# Altium project PCB_Project.PrjPcb (part 2 of 4)

## Sheet HDMI_MIPI-DSI_EDP.SchDoc
size A4; SheetNumber: 9; SheetTotal: 26
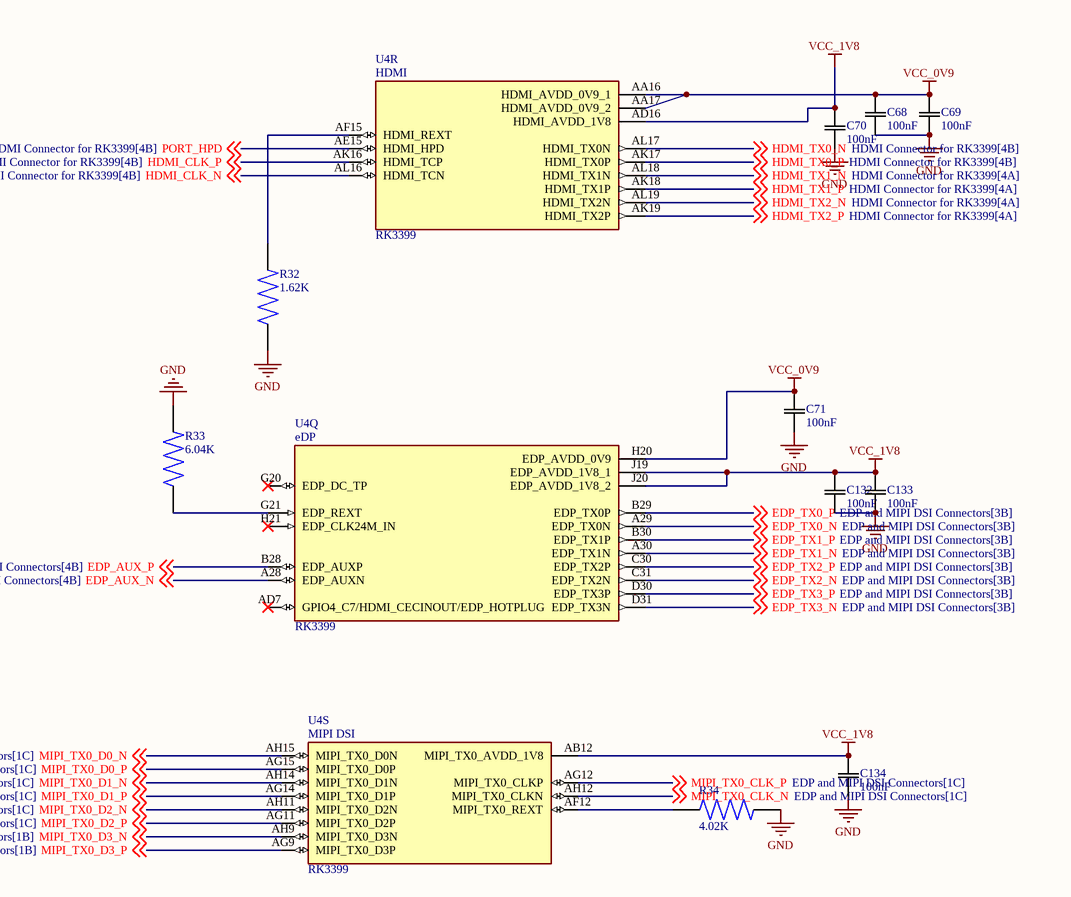
[diagram p8: HDMI_MIPI-DSI_EDP.SchDoc]

### Parts
C68  100nF  [CAP_1005_TDK]
C69  100nF  [CAP_1005_TDK]
C70  100nF  [CAP_1005_TDK]
C71  100nF  [CAP_1005_TDK]
C132  100nF  [CAP_1005_TDK]
C133  100nF  [CAP_1005_TDK]
C134  100nF  [CAP_1005_TDK]
R32  1.62K  [RES_ERA8APB1621V]
R33  6.04K  [RES_ERA8ARB6041V]
R34  4.02K  [RES_ERJP06F4021V]
U4  RK3399  [BGA828C65P31X31_2100X2100X161N]  (parts Q,R,S of 32)

### Nets
GND: C68.2 C69.2 C70.2 C71.2 C132.2 C133.2 C134.2 R32.1 R33.2 R34.2
VCC_0V9: C68.1 C69.1 C71.1 U4.AA16(HDMI_AVDD_0V9_1) U4.AA17(HDMI_AVDD_0V9_2) U4.H20(EDP_AVDD_0V9)
VCC_1V8: C70.1 C132.1 C133.1 C134.1 U4.AB12(MIPI_TX0_AVDD_1V8) U4.AD16(HDMI_AVDD_1V8) U4.J19(EDP_AVDD_1V8_1) U4.J20(EDP_AVDD_1V8_2)
EDP_AUX_N: U4.A28(EDP_AUXN) ; off-sheet EDP_AUX_N
EDP_AUX_P: U4.B28(EDP_AUXP) ; off-sheet EDP_AUX_P
EDP_TX0_N: U4.A29(EDP_TX0N) ; off-sheet EDP_TX0_N
EDP_TX0_P: U4.B29(EDP_TX0P) ; off-sheet EDP_TX0_P
EDP_TX1_N: U4.A30(EDP_TX1N) ; off-sheet EDP_TX1_N
EDP_TX1_P: U4.B30(EDP_TX1P) ; off-sheet EDP_TX1_P
EDP_TX2_N: U4.C31(EDP_TX2N) ; off-sheet EDP_TX2_N
EDP_TX2_P: U4.C30(EDP_TX2P) ; off-sheet EDP_TX2_P
EDP_TX3_N: U4.D31(EDP_TX3N) ; off-sheet EDP_TX3_N
EDP_TX3_P: U4.D30(EDP_TX3P) ; off-sheet EDP_TX3_P
HDMI_CLK_N: U4.AL16(HDMI_TCN) ; off-sheet HDMI_CLK_N
HDMI_CLK_P: U4.AK16(HDMI_TCP) ; off-sheet HDMI_CLK_P
HDMI_TX0_N: U4.AL17(HDMI_TX0N) ; off-sheet HDMI_TX0_N
HDMI_TX0_P: U4.AK17(HDMI_TX0P) ; off-sheet HDMI_TX0_P
HDMI_TX1_N: U4.AL18(HDMI_TX1N) ; off-sheet HDMI_TX1_N
HDMI_TX1_P: U4.AK18(HDMI_TX1P) ; off-sheet HDMI_TX1_P
HDMI_TX2_N: U4.AL19(HDMI_TX2N) ; off-sheet HDMI_TX2_N
HDMI_TX2_P: U4.AK19(HDMI_TX2P) ; off-sheet HDMI_TX2_P
MIPI_TX0_CLK_N: U4.AH12(MIPI_TX0_CLKN) ; off-sheet MIPI_TX0_CLK_N
MIPI_TX0_CLK_P: U4.AG12(MIPI_TX0_CLKP) ; off-sheet MIPI_TX0_CLK_P
MIPI_TX0_D0_N: U4.AH15(MIPI_TX0_D0N) ; off-sheet MIPI_TX0_D0_N
MIPI_TX0_D0_P: U4.AG15(MIPI_TX0_D0P) ; off-sheet MIPI_TX0_D0_P
MIPI_TX0_D1_N: U4.AH14(MIPI_TX0_D1N) ; off-sheet MIPI_TX0_D1_N
MIPI_TX0_D1_P: U4.AG14(MIPI_TX0_D1P) ; off-sheet MIPI_TX0_D1_P
MIPI_TX0_D2_N: U4.AH11(MIPI_TX0_D2N) ; off-sheet MIPI_TX0_D2_N
MIPI_TX0_D2_P: U4.AG11(MIPI_TX0_D2P) ; off-sheet MIPI_TX0_D2_P
MIPI_TX0_D3_N: U4.AH9(MIPI_TX0_D3N) ; off-sheet MIPI_TX0_D3_N
MIPI_TX0_D3_P: U4.AG9(MIPI_TX0_D3P) ; off-sheet MIPI_TX0_D3_P
PORT_HPD: U4.AE15(HDMI_HPD) ; off-sheet PORT_HPD
NetR32_2: R32.2 U4.AF15(HDMI_REXT)
NetR33_1: R33.1 U4.G21(EDP_REXT)
NetR34_1: R34.1 U4.AF12(MIPI_TX0_REXT)

Not connected (* = marked no-connect by the designer): U4 AD7(GPIO4_C7/HDMI_CECINOUT/EDP_HOTPLUG)* G20(EDP_DC_TP)* H21(EDP_CLK24M_IN)*

### Notes on the sheet
- (in symbol RK3399, part Q) eDP
- (in symbol RK3399, part R) HDMI
- (in symbol RK3399, part S) MIPI DSI

### Library data of the parts
C68-C71 C132-C134 = C1005X7R1H104M050BB: Description; Manufacturer_Name: TDK; Copyright: Copyright (C) 2025 Ultra Librarian. All rights reserved.; Manufacturer_Part_Number: C1005X7R1H104M050BB
R32 = ERA8APB1621V: Value: *; Price: None; Availability: Unavailable; Package: None; MP: ERA8APB1621V
R33 = ERA8ARB6041V: Package: None; MP: ERA8ARB6041V; Value: *; Availability: Unavailable; Price: None
R34 = ERJP06F4021V: Price: None; Value: *; Availability: Unavailable; Package: None; MP: ERJP06F4021V
U4 = RK3399: RK3399 ROCK Pi 4 Model A 2GB - ARMÂ® CortexÂ®-A53, CortexÂ®-A72 MPU Embedded Evaluation Board; MF: Rockchip; SnapEDA_Link: https://www.snapeda.com/parts/RK3399/Fuzhou+Rockchip+Electronics+Co/view-part/?ref=snap; Package: Seeed Technology; MP: RK3399; Check_prices: https://www.snapeda.com/parts/RK3399/Fuzhou+Rockchip+Electronics+Co/view-part/?ref=eda; Price: None; Value: *; Availability: Not in stock

## Sheet HDMI Connector for RK3399.SchDoc
size A4; SheetNumber: 10; SheetTotal: 26
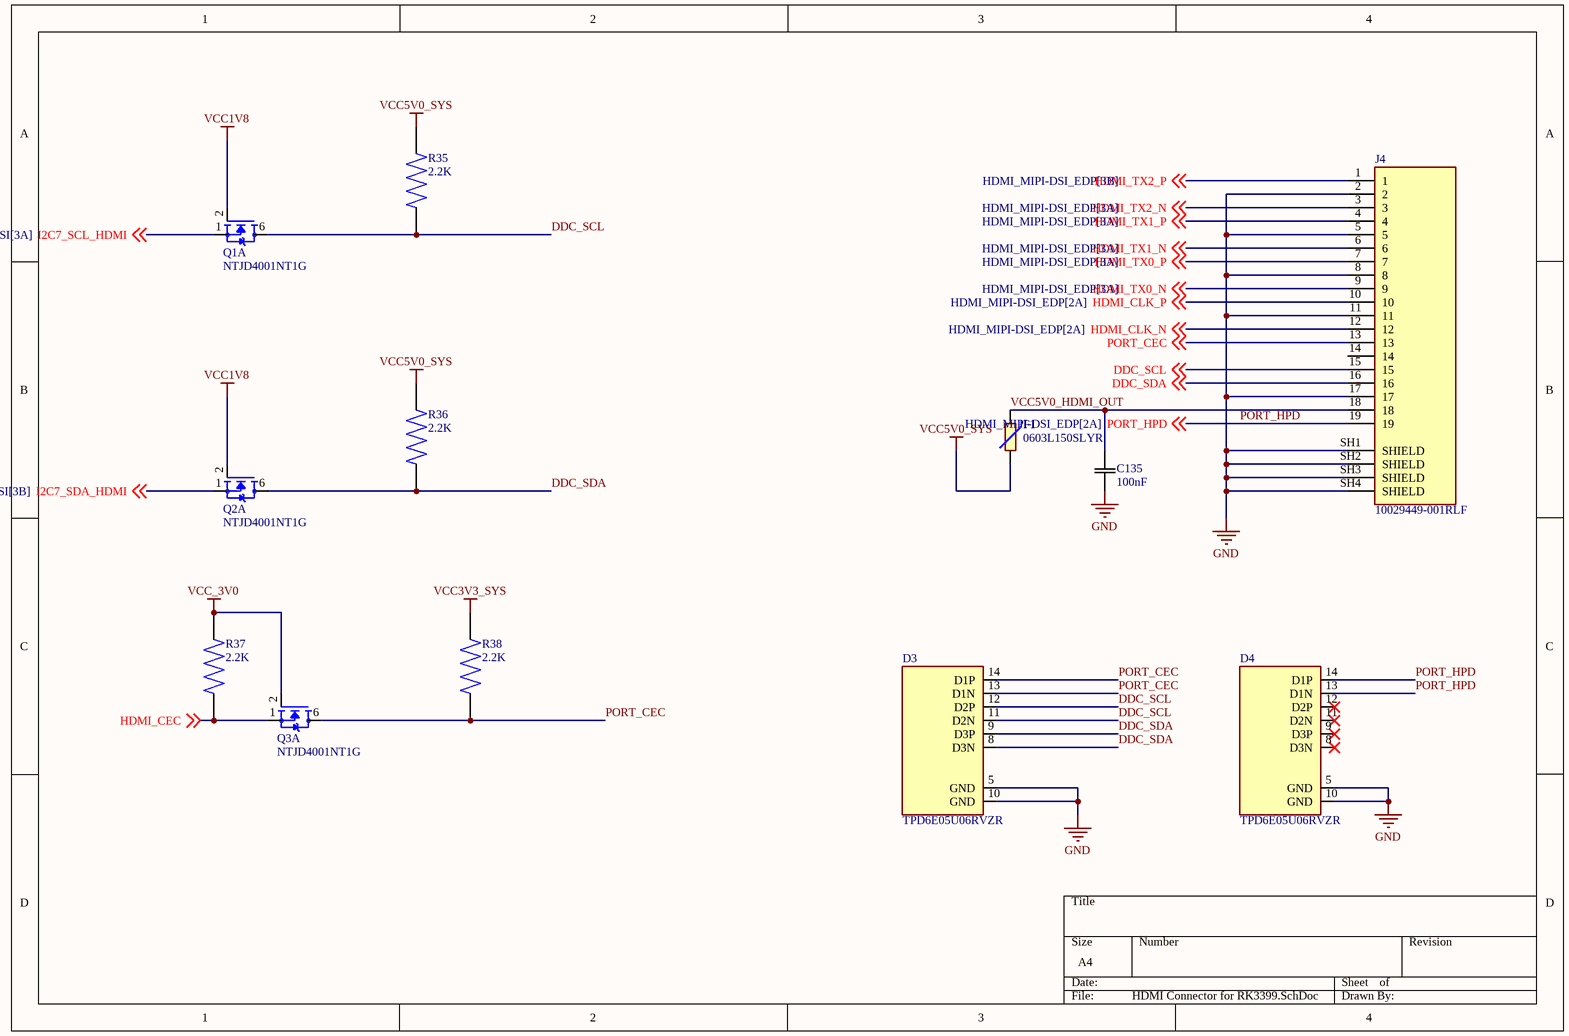
[diagram p9: HDMI Connector for RK3399.SchDoc]

### Parts
C135  100nF  [CAP_1005_TDK]
D3  TPD6E05U06RVZR  [SON50P135X350X55-14N]
D4  TPD6E05U06RVZR  [SON50P135X350X55-14N]
F1  0603L150SLYR  [FUSC1608X100N]
J4  10029449-001RLF  [AMPHENOL_10029449-001RLF]
Q1  NTJD4001NT1G  [SOT65P210X110-6N]  (part A of 2)
Q2  NTJD4001NT1G  [SOT65P210X110-6N]  (part A of 2)
Q3  NTJD4001NT1G  [SOT65P210X110-6N]  (part A of 2)
R35  2.2K  [RES_ERA8APB222V]
R36  2.2K  [RES_ERA8APB222V]
R37  2.2K  [RES_ERA8APB222V]
R38  2.2K  [RES_ERA8APB222V]

### Nets
GND: C135.2 D3.5(GND) D3.10(GND) D4.5(GND) D4.10(GND) J4.2 J4.5 J4.8 J4.11 J4.17 J4.SH1(SHIELD) J4.SH2(SHIELD) J4.SH3(SHIELD) J4.SH4(SHIELD)
VCC1V8: Q1.2(G1) Q2.2(G1)
VCC3V3_SYS: R38.2
VCC5V0_SYS: F1.2 R35.2 R36.2
VCC_3V0: Q3.2(G1) R37.2
DDC_SCL: D3.11(D2N) D3.12(D2P) J4.15 Q1.6(D1) R35.1 ; off-sheet DDC_SCL
DDC_SDA: D3.8(D3N) D3.9(D3P) J4.16 Q2.6(D1) R36.1 ; off-sheet DDC_SDA
HDMI_CEC: Q3.1(S1) R37.1 ; off-sheet HDMI_CEC
HDMI_CLK_N: J4.12 ; off-sheet HDMI_CLK_N
HDMI_CLK_P: J4.10 ; off-sheet HDMI_CLK_P
HDMI_TX0_N: J4.9 ; off-sheet HDMI_TX0_N
HDMI_TX0_P: J4.7 ; off-sheet HDMI_TX0_P
HDMI_TX1_N: J4.6 ; off-sheet HDMI_TX1_N
HDMI_TX1_P: J4.4 ; off-sheet HDMI_TX1_P
HDMI_TX2_N: J4.3 ; off-sheet HDMI_TX2_N
HDMI_TX2_P: J4.1 ; off-sheet HDMI_TX2_P
I2C7_SCL_HDMI: Q1.1(S1) ; off-sheet I2C7_SCL_HDMI
I2C7_SDA_HDMI: Q2.1(S1) ; off-sheet I2C7_SDA_HDMI
PORT_CEC: D3.13(D1N) D3.14(D1P) J4.13 Q3.6(D1) R38.1 ; off-sheet PORT_CEC
PORT_HPD: D4.13(D1N) D4.14(D1P) J4.19 ; off-sheet PORT_HPD
VCC5V0_HDMI_OUT: C135.1 F1.1 J4.18

Not connected (* = marked no-connect by the designer): D4 8(D3N)* 9(D3P)* 11(D2N)* 12(D2P)*; J4 14

### Library data of the parts
C135 = C1005X7R1H104M050BB: Description; Manufacturer_Name: TDK; Copyright: Copyright (C) 2025 Ultra Librarian. All rights reserved.; Manufacturer_Part_Number: C1005X7R1H104M050BB
D3 D4 = TPD6E05U06RVZR: 6-Channel Ultra low capacitance IEC ESD protection diodes 14-USON -40 to 125; MP: TPD6E05U06RVZR; Price: None; Package: None; Value: *; Availability: Unavailable
F1 = 0603L150SLYR: Polymeric PTC Resettable Fuse 6V 1.5 A Ih Surface Mount 0603 (1608 Metric), Concave; MF: Littelfuse Inc.; SnapEDA_Link: https://www.snapeda.com/parts/0603L150SLYR/Littelfuse/view-part/?ref=snap; Package: 0603-2 LITTELFUSE; Value: *; MP: 0603L150SLYR; Check_prices: https://www.snapeda.com/parts/0603L150SLYR/Littelfuse/view-part/?ref=eda
Q1-Q3 = NTJD4001NT1G: Mosfet Array 2 N-Channel (Dual) 30V 250mA 272mW Surface Mount SC-88/SC70-6/SOT-363; MF: ON Semiconductor; SnapEDA_Link: https://www.snapeda.com/parts/NTJD4001NT1G/Onsemi/view-part/?ref=snap; Package: SC-88-6 ON Semiconductor; Value: *; MP: NTJD4001NT1G; Check_prices: https://www.snapeda.com/parts/NTJD4001NT1G/Onsemi/view-part/?ref=eda
R35-R38 = ERA8APB222V: Availability: Unavailable; Price: None; Package: None; MP: ERA8APB222V; Value: *
J4 = 10029449-001RLF: Package: None; Price: None; Value: *; MP: 10029449-001RLF; Availability: Unavailable

## Sheet PMIC_Block_.SchDoc
size A3; SheetNumber: 11; SheetTotal: 26
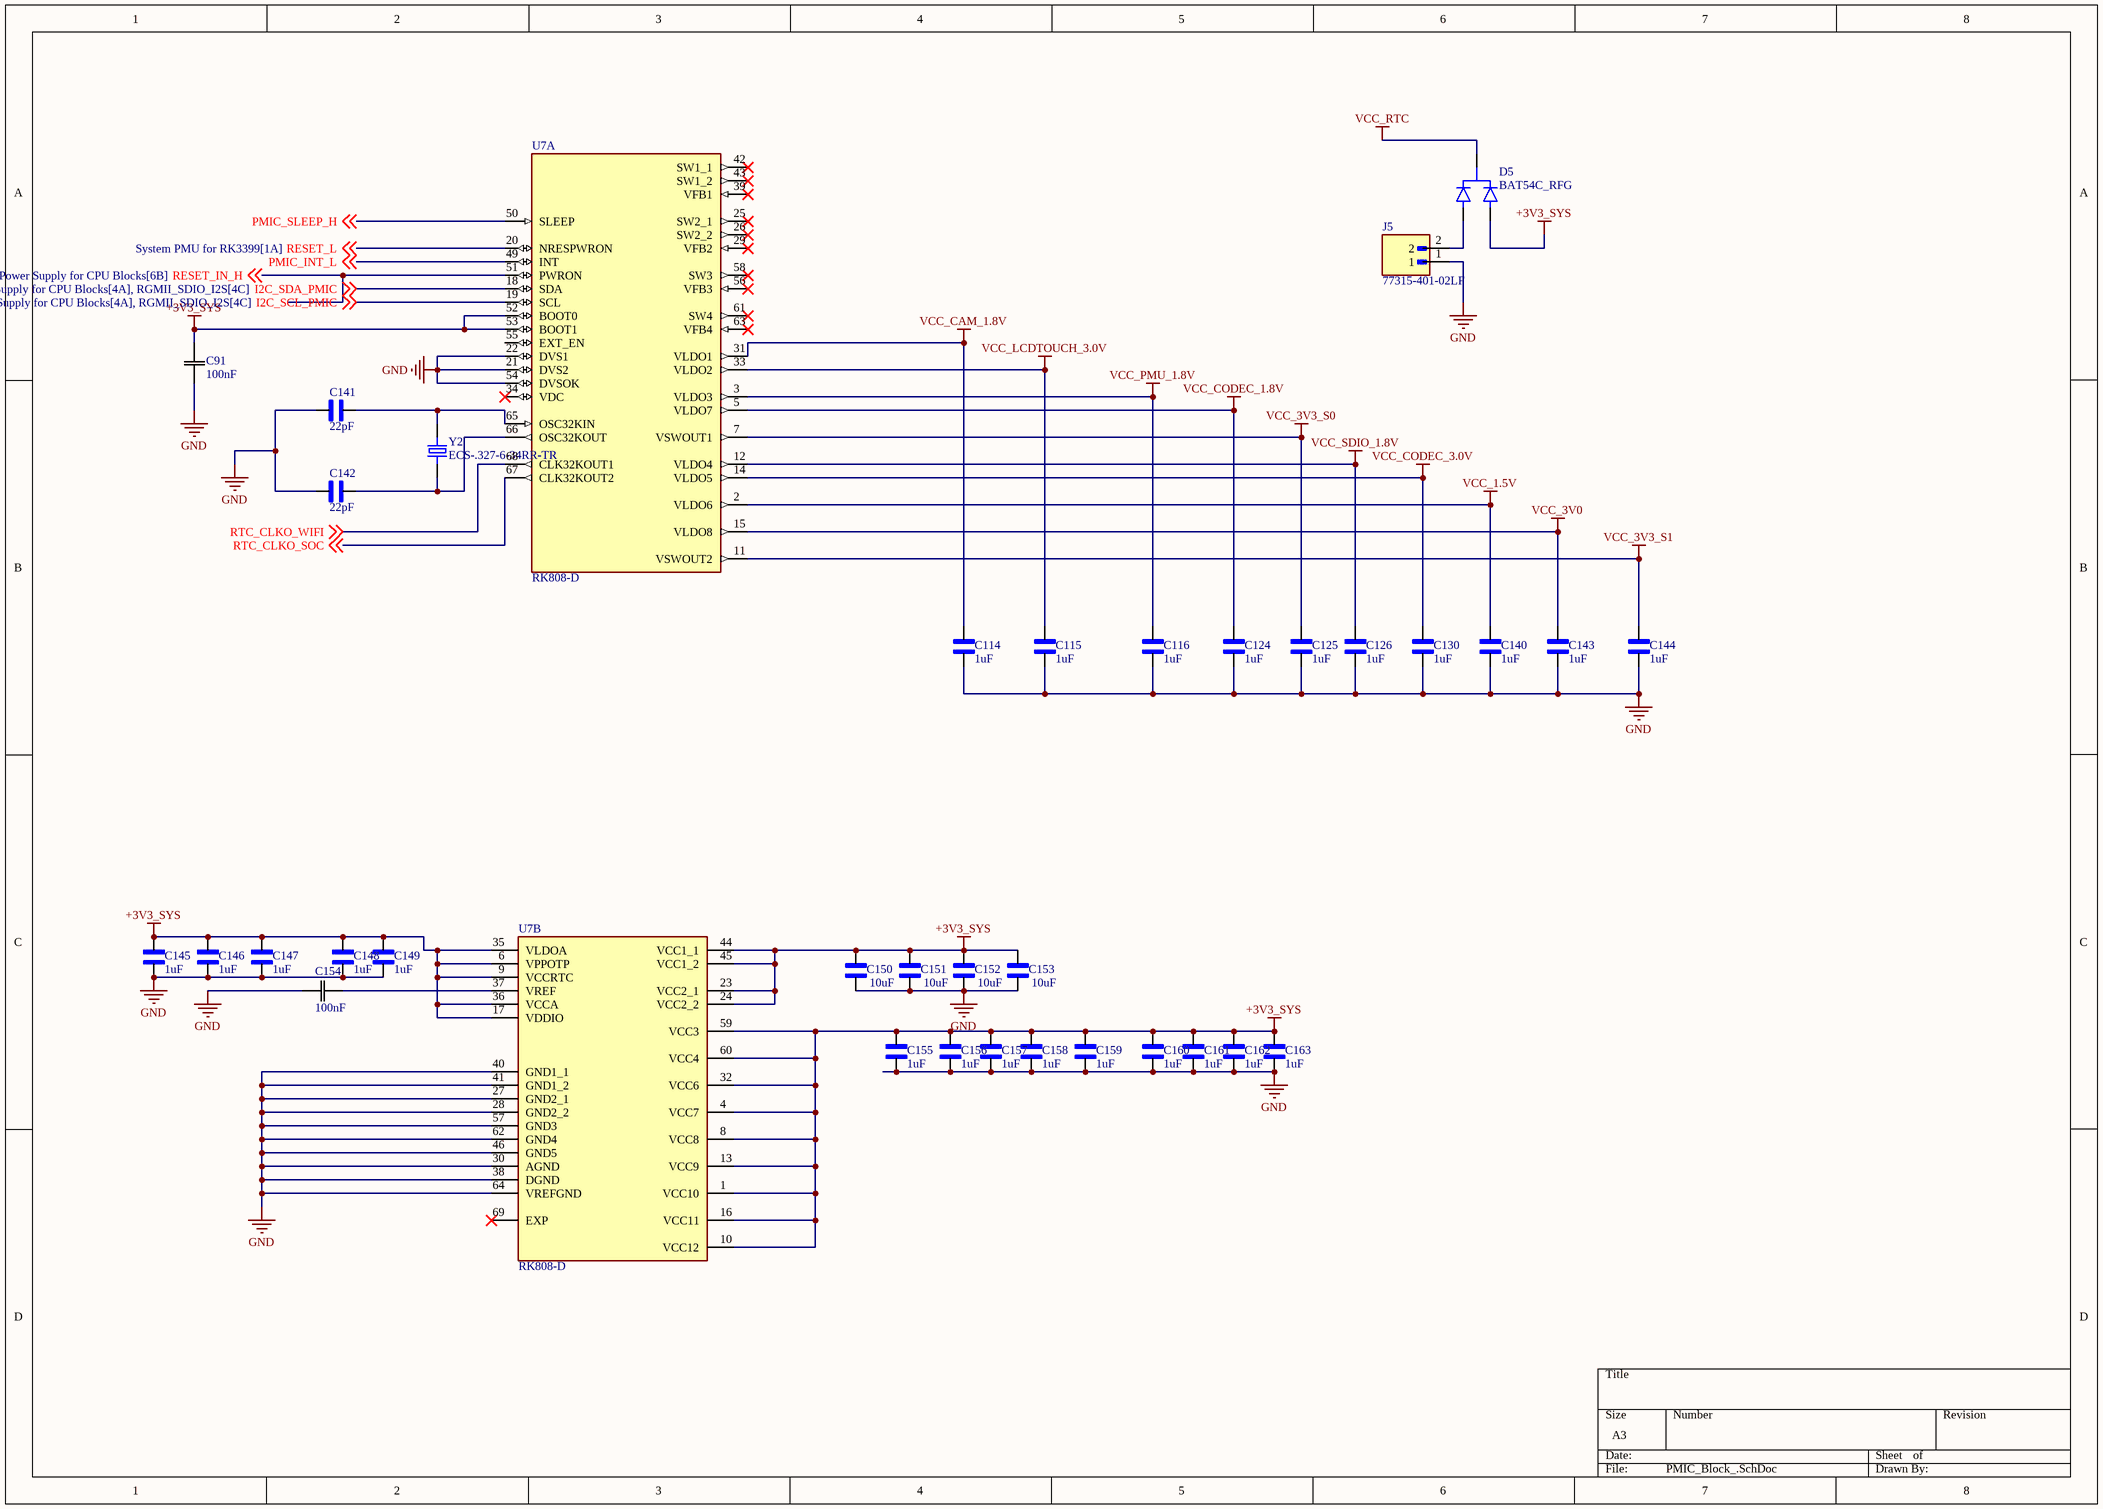
[diagram p10: PMIC_Block_.SchDoc]

### Parts
C91  100nF  [CAP_1005_TDK]
C114  1uF  [CAPC1005X56N]
C115  1uF  [CAPC1005X56N]
C116  1uF  [CAPC1005X56N]
C124  1uF  [CAPC1005X56N]
C125  1uF  [CAPC1005X56N]
C126  1uF  [CAPC1005X56N]
C130  1uF  [CAPC1005X56N]
C140  1uF  [CAPC1005X56N]
C141  22pF  [CAPC2012X140N]
C142  22pF  [CAPC2012X140N]
C143  1uF  [CAPC1005X56N]
C144  1uF  [CAPC1005X56N]
C145  1uF  [CAPC1005X56N]
C146  1uF  [CAPC1005X56N]
C147  1uF  [CAPC1005X56N]
C148  1uF  [CAPC1005X56N]
C149  1uF  [CAPC1005X56N]
C150  10uF  [CAPC1005X70N]
C151  10uF  [CAPC1005X70N]
C152  10uF  [CAPC1005X70N]
C153  10uF  [CAPC1005X70N]
C154  100nF  [CAP_1005_TDK]
C155  1uF  [CAPC1005X56N]
C156  1uF  [CAPC1005X56N]
C157  1uF  [CAPC1005X56N]
C158  1uF  [CAPC1005X56N]
C159  1uF  [CAPC1005X56N]
C160  1uF  [CAPC1005X56N]
C161  1uF  [CAPC1005X56N]
C162  1uF  [CAPC1005X56N]
C163  1uF  [CAPC1005X56N]
D5  BAT54C_RFG  [SOT95P237X112-3N]
J5  77315-401-02LF  [AMPHENOL_77315-401-02LF]
U7  RK808-D  [QFN35P700X700X80-69N]  (parts A,B of 2)
Y2  ECS-.327-6-34RR-TR  [XTAL_ECS-.327-6-34RR-TR]

### Nets
+3V3_SYS: C91.2 C145.2 C146.2 C147.2 C148.2 C149.2 C150.2 C151.2 C152.2 C153.2 C155.2 C156.2 C157.2 C158.2 C159.2 C160.2 C161.2 C162.2 C163.2 D5.2 U7.1(VCC10) U7.4(VCC7) U7.6(VPPOTP) U7.8(VCC8) U7.9(VCCRTC) U7.10(VCC12) U7.13(VCC9) U7.16(VCC11) U7.17(VDDIO) U7.23(VCC2_1) U7.24(VCC2_2) U7.32(VCC6) U7.35(VLDOA) U7.36(VCCA) U7.44(VCC1_1) U7.45(VCC1_2) U7.52(BOOT0) U7.53(BOOT1) U7.59(VCC3) U7.60(VCC4)
GND: C91.1 C114.1 C115.1 C116.1 C124.1 C125.1 C126.1 C130.1 C140.1 C141.2 C142.2 C143.1 C144.1 C145.1 C146.1 C147.1 C148.1 C149.1 C150.1 C151.1 C152.1 C153.1 C154.2 C155.1 C156.1 C157.1 C158.1 C159.1 C160.1 C161.1 C162.1 C163.1 J5.1 U7.21(DVS2) U7.22(DVS1) U7.27(GND2_1) U7.28(GND2_2) U7.30(AGND) U7.38(DGND) U7.40(GND1_1) U7.41(GND1_2) U7.46(GND5) U7.54(DVSOK) U7.57(GND3) U7.62(GND4) U7.64(VREFGND)
RESET_IN_H: U7.51(PWRON) ; off-sheet RESET_IN_H  [project net VCC3V3_S5]
VCC_1.5V: C140.2 U7.2(VLDO6)
VCC_3V0: C143.2 U7.15(VLDO8)
VCC_3V3_S0: C125.2 U7.7(VSWOUT1)
VCC_3V3_S1: C144.2 U7.11(VSWOUT2)
VCC_CAM_1.8V: C114.2 U7.31(VLDO1)
VCC_CODEC_1.8V: C124.2 U7.5(VLDO7)
VCC_CODEC_3.0V: C130.2 U7.14(VLDO5)
VCC_LCDTOUCH_3.0V: C115.2 U7.33(VLDO2)
VCC_PMU_1.8V: C116.2 U7.3(VLDO3)
VCC_RTC: D5.3
VCC_SDIO_1.8V: C126.2 U7.12(VLDO4)
I2C_SCL_PMIC: U7.19(SCL) ; off-sheet I2C_SCL_PMIC
I2C_SDA_PMIC: U7.18(SDA) ; off-sheet I2C_SDA_PMIC
PMIC_INT_L: U7.49(INT) ; off-sheet PMIC_INT_L
PMIC_SLEEP_H: U7.50(SLEEP) ; off-sheet PMIC_SLEEP_H
RESET_L: U7.20(NRESPWRON) ; off-sheet RESET_L
RTC_CLKO_SOC: U7.67(CLK32KOUT2) ; off-sheet RTC_CLKO_SOC
RTC_CLKO_WIFI: U7.68(CLK32KOUT1) ; off-sheet RTC_CLKO_WIFI
NetC141_1: C141.1 U7.65(OSC32KIN) Y2.2(O/I)
NetC142_1: C142.1 U7.66(OSC32KOUT) Y2.1(I/O)
NetC154_1: C154.1 U7.37(VREF)
NetD5_1: D5.1 J5.2

Not connected (* = marked no-connect by the designer): U7 25(SW2_1)* 26(SW2_2)* 29(VFB2)* 34(VDC)* 39(VFB1)* 42(SW1_1)* 43(SW1_2)* 55(EXT_EN) 56(VFB3)* 58(SW3)* 61(SW4)* 63(VFB4)* 69(EXP)*

### Library data of the parts
C91 C154 = C1005X7R1H104M050BB: Description; Manufacturer_Name: TDK; Copyright: Copyright (C) 2025 Ultra Librarian. All rights reserved.; Manufacturer_Part_Number: C1005X7R1H104M050BB
C114-C116 C124-C126 C130 C140 C143-C149 C155-C163 = 0402ZD105KAT4A: as C13 on sheet TYPEC0; SnapEDA_Link: https://www.snapeda.com/parts/0402ZD105KAT4A/AVX/view-part/?ref=snap; Package: 1005 AVX; Value: *; MP: 0402ZD105KAT4A; Check_prices: https://www.snapeda.com/parts/0402ZD105KAT4A/AVX/view-part/?ref=eda
C141 C142 = C0805C220J5GACTU: Capacitor, Ceramic, Cap, 22.0pF, Tol 5%, SMT, 50V, C0G | KEMET C0805C220J5GACTU; SnapEDA_Link: https://www.snapeda.com/parts/C0805C220J5GACTU/KEMET/view-part/?ref=snap; Package: 0805 Kemet; Value: *; MF: KEMET; MP: C0805C220J5GACTU; Check_prices: https://www.snapeda.com/parts/C0805C220J5GACTU/KEMET/view-part/?ref=eda
C150-C153 = CL05A106MQ5NUNC: as C1 on sheet USB2.0; SnapEDA_Link: https://www.snapeda.com/parts/CL05A106MQ5NUNC/Samsung/view-part/?ref=snap; Package: SMD-2 Samsung; Value: *; MP: CL05A106MQ5NUNC; Check_prices: https://www.snapeda.com/parts/CL05A106MQ5NUNC/Samsung/view-part/?ref=eda
D5 = BAT54C_RFG: SOT-23, 30V, 0.2A, Schottky Diode; MF: Taiwan Semiconductor; MP: BAT54C RF; SnapEDA_Link: https://www.snapeda.com/parts/BAT54C%20RF/Taiwan+Semiconductor/view-part/?ref=snap; Package: SOT-23 Taiwan Semiconductor; Value: *; Check_prices: https://www.snapeda.com/parts/BAT54C%20RF/Taiwan+Semiconductor/view-part/?ref=eda
U7 = RK808-D: RK808-D Power Management IC; MF: rockchip; SnapEDA_Link: https://www.snapeda.com/parts/RK808-D/Rockchip/view-part/?ref=snap; Package: None; Value: *; MP: RK808-D; Check_prices: https://www.snapeda.com/parts/RK808-D/Rockchip/view-part/?ref=eda
Y2 = ECS-.327-6-34RR-TR: 32.768kHz 20ppm Crystal 6pF 20 kOhm -40C ~ 85C Surface Mount 2-SMD, No Lead 3.2 x 1.5; MF: ECS Inc.; SnapEDA_Link: https://www.snapeda.com/parts/ECS-.327-6-34RR-TR/ECS/view-part/?ref=snap; Package: ECX-34RR-34RR-2 ECS; Value: *; MP: ECS-.327-6-34RR-TR; Check_prices: https://www.snapeda.com/parts/ECS-.327-6-34RR-TR/ECS/view-part/?ref=eda
J5 = 77315-401-02LF: Package: None; Price: None; Value: *; MP: 77315-401-02LF; Availability: Unavailable

## Sheet LPDDR4 SDRAM_1.SchDoc
size 420 x 297 mm; SheetNumber: 12; SheetTotal: 26
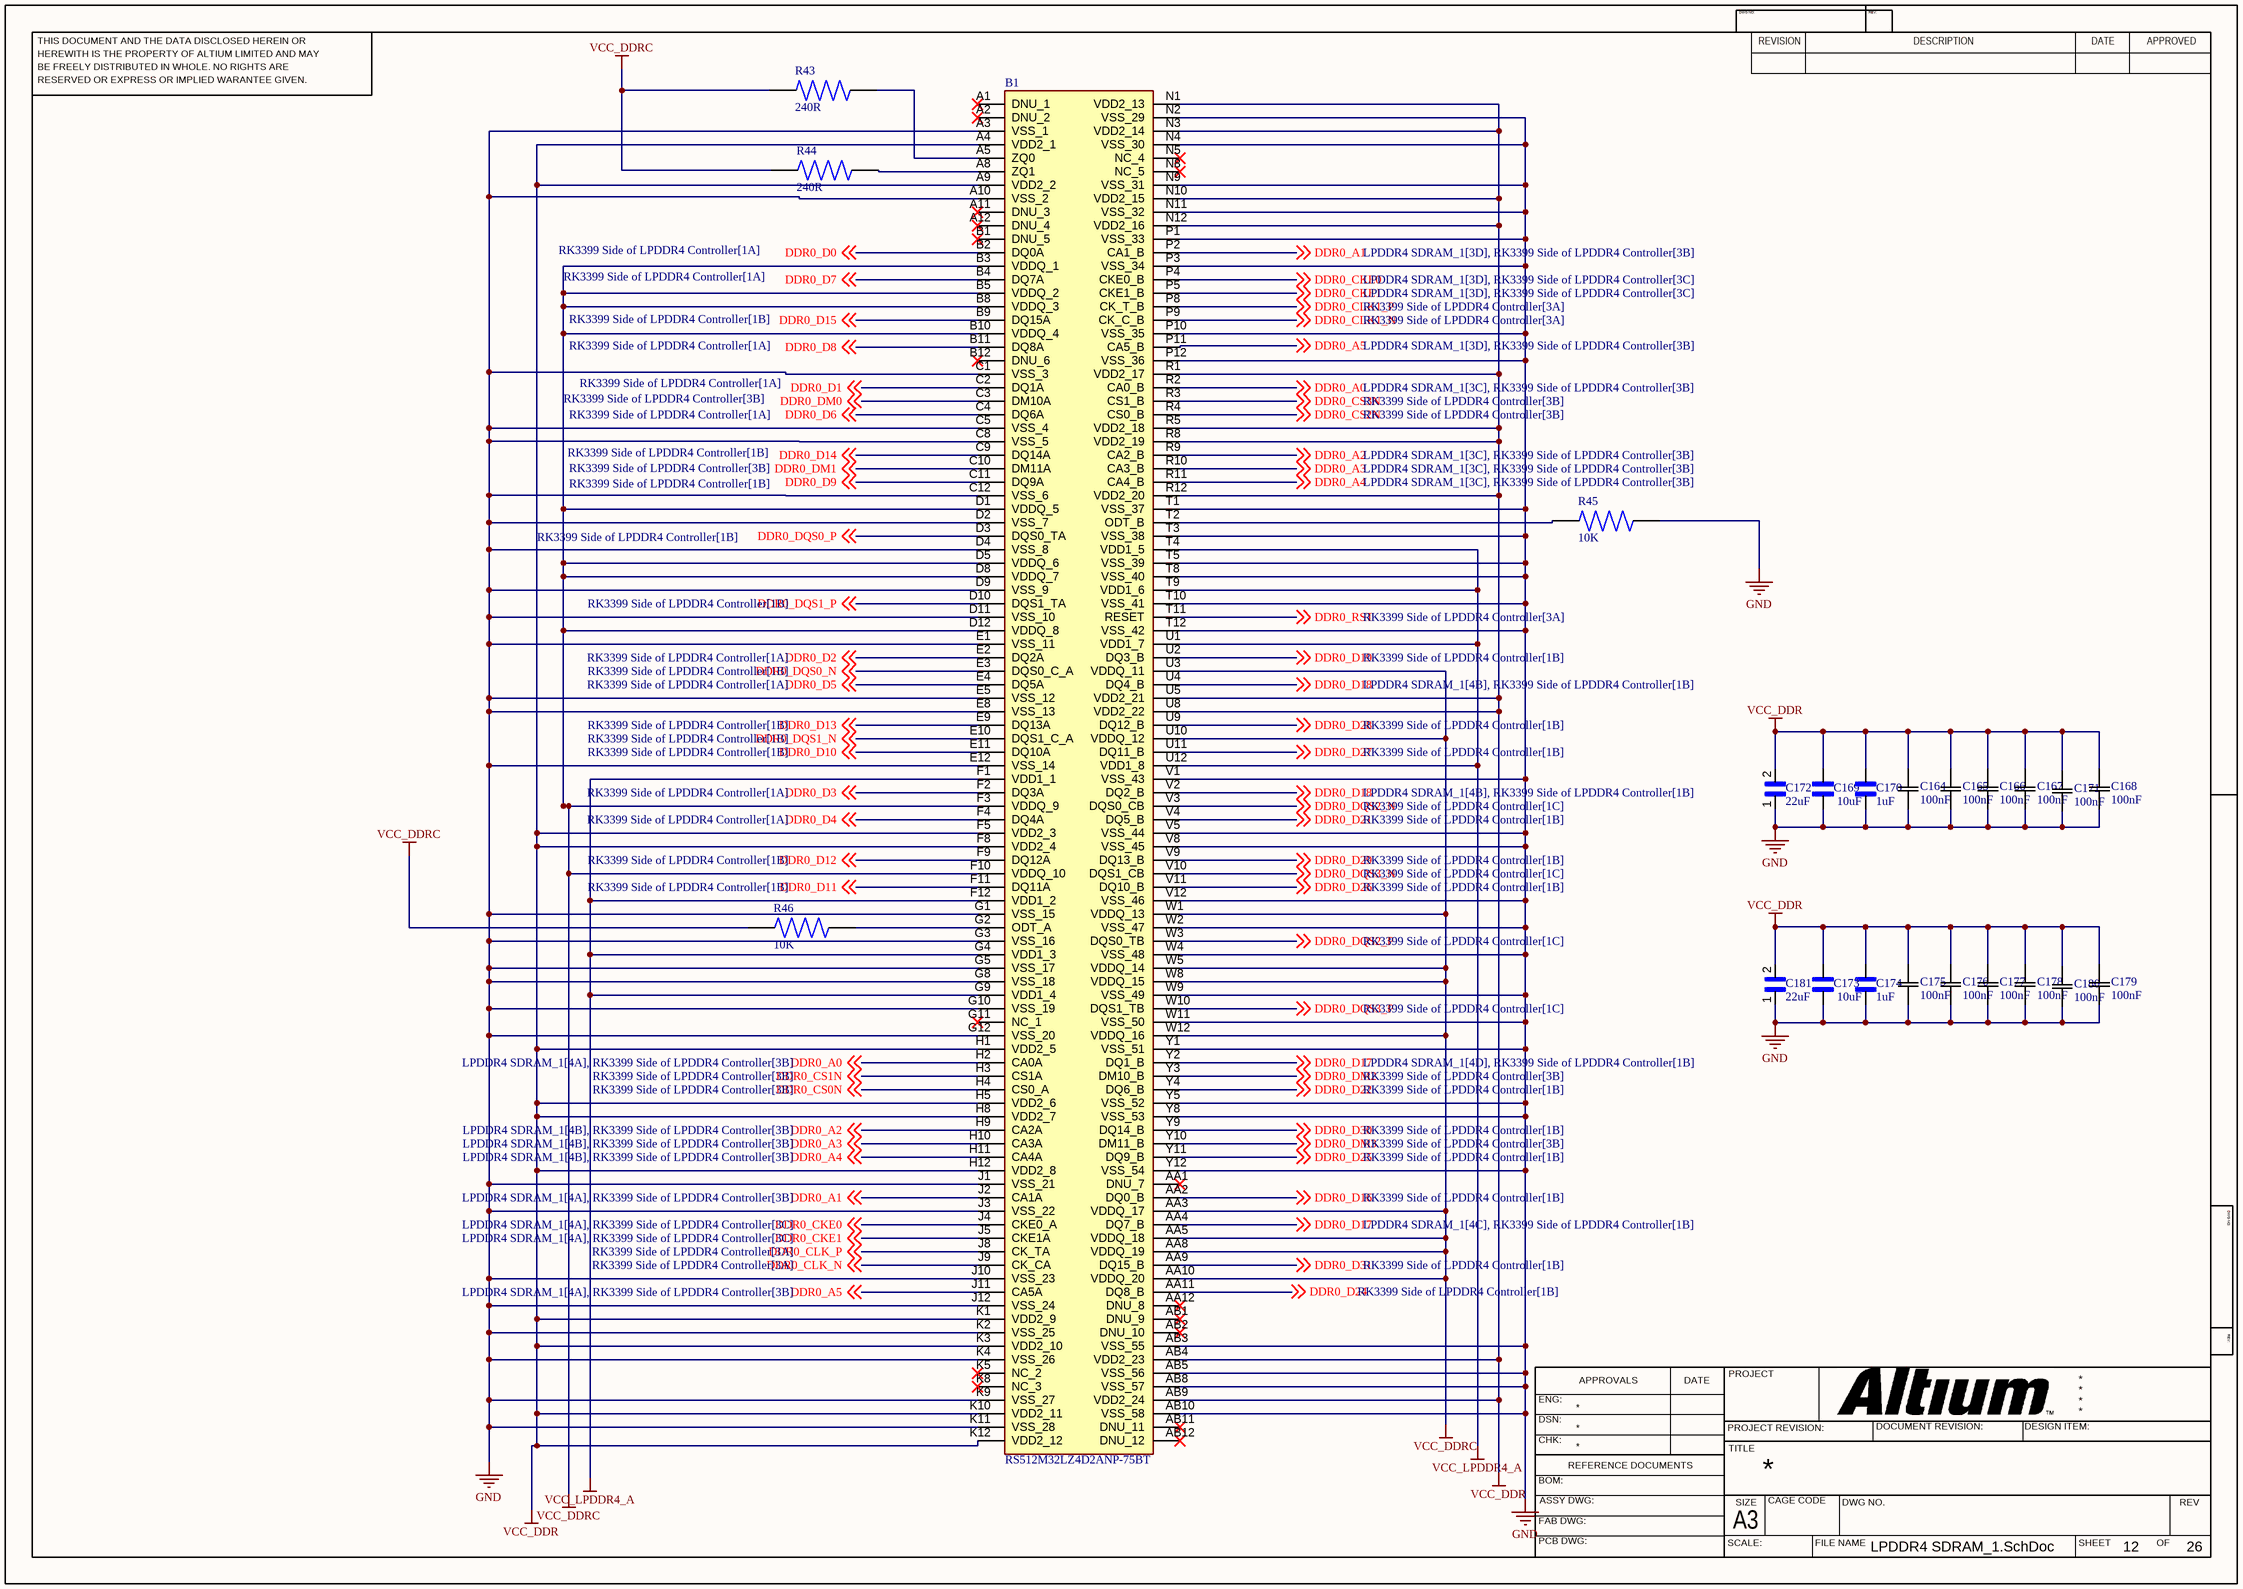
[diagram p11: LPDDR4 SDRAM_1.SchDoc]

### Parts
B1  RS512M32LZ4D2ANP-75BT  [BGA200C65P12X22_1000X1500X100]
C164  100nF  [CAP_1005_TDK]
C165  100nF  [CAP_1005_TDK]
C166  100nF  [CAP_1005_TDK]
C167  100nF  [CAP_1005_TDK]
C168  100nF  [CAP_1005_TDK]
C169  10uF  [CAPC1005X70N]
C170  1uF  [CAPC1005X56N]
C171  100nF  [CAP_1005_TDK]
C172  22uF  [CAPC6050X550N]
C173  10uF  [CAPC1005X70N]
C174  1uF  [CAPC1005X56N]
C175  100nF  [CAP_1005_TDK]
C176  100nF  [CAP_1005_TDK]
C177  100nF  [CAP_1005_TDK]
C178  100nF  [CAP_1005_TDK]
C179  100nF  [CAP_1005_TDK]
C180  100nF  [CAP_1005_TDK]
C181  22uF  [CAPC6050X550N]
R43  240R  [RESC1608X50N]
R44  240R  [RESC1608X50N]
R45  10K  [RESC1608X55N]
R46  10K  [RESC1608X55N]

### Nets
GND: B1.A3(VSS_1) B1.A10(VSS_2) B1.AB3(VSS_55) B1.AB5(VSS_56) B1.AB8(VSS_57) B1.AB10(VSS_58) B1.C1(VSS_3) B1.C5(VSS_4) B1.C8(VSS_5) B1.C12(VSS_6) B1.D2(VSS_7) B1.D4(VSS_8) B1.D9(VSS_9) B1.D11(VSS_10) B1.E1(VSS_11) B1.E5(VSS_12) B1.E8(VSS_13) B1.E12(VSS_14) B1.G1(VSS_15) B1.G3(VSS_16) B1.G5(VSS_17) B1.G8(VSS_18) B1.G10(VSS_19) B1.G12(VSS_20) B1.J1(VSS_21) B1.J3(VSS_22) B1.J10(VSS_23) B1.J12(VSS_24) B1.K2(VSS_25) B1.K4(VSS_26) B1.K9(VSS_27) B1.K11(VSS_28) B1.N2(VSS_29) B1.N4(VSS_30) B1.N9(VSS_31) B1.N11(VSS_32) B1.P1(VSS_33) B1.P3(VSS_34) B1.P10(VSS_35) B1.P12(VSS_36) B1.T1(VSS_37) B1.T3(VSS_38) B1.T5(VSS_39) B1.T8(VSS_40) B1.T10(VSS_41) B1.T12(VSS_42) B1.V1(VSS_43) B1.V5(VSS_44) B1.V8(VSS_45) B1.V12(VSS_46) B1.W2(VSS_47) B1.W4(VSS_48) B1.W9(VSS_49) B1.W11(VSS_50) B1.Y1(VSS_51) B1.Y5(VSS_52) B1.Y8(VSS_53) B1.Y12(VSS_54) C164.1 C165.1 C166.1 C167.1 C168.1 C169.1 C170.1 C171.1 C172.1 C173.1 C174.1 C175.1 C176.1 C177.1 C178.1 C179.1 C180.1 C181.1 R45.2
VCC_DDR: B1.A4(VDD2_1) B1.A9(VDD2_2) B1.AB4(VDD2_23) B1.AB9(VDD2_24) B1.F5(VDD2_3) B1.F8(VDD2_4) B1.H1(VDD2_5) B1.H5(VDD2_6) B1.H8(VDD2_7) B1.H12(VDD2_8) B1.K1(VDD2_9) B1.K3(VDD2_10) B1.K10(VDD2_11) B1.K12(VDD2_12) B1.N1(VDD2_13) B1.N3(VDD2_14) B1.N10(VDD2_15) B1.N12(VDD2_16) B1.R1(VDD2_17) B1.R5(VDD2_18) B1.R8(VDD2_19) B1.R12(VDD2_20) B1.U5(VDD2_21) B1.U8(VDD2_22) C164.2 C165.2 C166.2 C167.2 C168.2 C169.2 C170.2 C171.2 C172.2 C173.2 C174.2 C175.2 C176.2 C177.2 C178.2 C179.2 C180.2 C181.2
VCC_DDRC: B1.AA3(VDDQ_17) B1.AA5(VDDQ_18) B1.AA8(VDDQ_19) B1.AA10(VDDQ_20) B1.B3(VDDQ_1) B1.B5(VDDQ_2) B1.B8(VDDQ_3) B1.B10(VDDQ_4) B1.D1(VDDQ_5) B1.D5(VDDQ_6) B1.D8(VDDQ_7) B1.D12(VDDQ_8) B1.F3(VDDQ_9) B1.F10(VDDQ_10) B1.U3(VDDQ_11) B1.U10(VDDQ_12) B1.W1(VDDQ_13) B1.W5(VDDQ_14) B1.W8(VDDQ_15) B1.W12(VDDQ_16) R43.1 R44.1 R46.2
VCC_LPDDR4_A: B1.F1(VDD1_1) B1.F12(VDD1_2) B1.G4(VDD1_3) B1.G9(VDD1_4) B1.T4(VDD1_5) B1.T9(VDD1_6) B1.U1(VDD1_7) B1.U12(VDD1_8)
DDR0_A0: B1.H2(CA0A) B1.R2(CA0_B) ; off-sheet DDR0_A0
DDR0_A1: B1.J2(CA1A) B1.P2(CA1_B) ; off-sheet DDR0_A1
DDR0_A2: B1.H9(CA2A) B1.R9(CA2_B) ; off-sheet DDR0_A2
DDR0_A3: B1.H10(CA3A) B1.R10(CA3_B) ; off-sheet DDR0_A3
DDR0_A4: B1.H11(CA4A) B1.R11(CA4_B) ; off-sheet DDR0_A4
DDR0_A5: B1.J11(CA5A) B1.P11(CA5_B) ; off-sheet DDR0_A5
DDR0_CKE0: B1.J4(CKE0_A) B1.P4(CKE0_B) ; off-sheet DDR0_CKE0
DDR0_CKE1: B1.J5(CKE1A) B1.P5(CKE1_B) ; off-sheet DDR0_CKE1
DDR0_CLK1_N: B1.P9(CK_C_B) ; off-sheet DDR0_CLK1_N
DDR0_CLK1_P: B1.P8(CK_T_B) ; off-sheet DDR0_CLK1_P
DDR0_CLK_N: B1.J9(CK_CA) ; off-sheet DDR0_CLK_N
DDR0_CLK_P: B1.J8(CK_TA) ; off-sheet DDR0_CLK_P
DDR0_CS0N: B1.H4(CS0_A) ; off-sheet DDR0_CS0N
DDR0_CS1N: B1.H3(CS1A) ; off-sheet DDR0_CS1N
DDR0_CS2N: B1.R4(CS0_B) ; off-sheet DDR0_CS2N
DDR0_CS3N: B1.R3(CS1_B) ; off-sheet DDR0_CS3N
DDR0_D0: B1.B2(DQ0A) ; off-sheet DDR0_D0
DDR0_D1: B1.C2(DQ1A) ; off-sheet DDR0_D1
DDR0_D2: B1.E2(DQ2A) ; off-sheet DDR0_D2
DDR0_D3: B1.F2(DQ3A) ; off-sheet DDR0_D3
DDR0_D4: B1.F4(DQ4A) ; off-sheet DDR0_D4
DDR0_D5: B1.E4(DQ5A) ; off-sheet DDR0_D5
DDR0_D6: B1.C4(DQ6A) ; off-sheet DDR0_D6
DDR0_D7: B1.B4(DQ7A) ; off-sheet DDR0_D7
DDR0_D8: B1.B11(DQ8A) ; off-sheet DDR0_D8
DDR0_D9: B1.C11(DQ9A) ; off-sheet DDR0_D9
DDR0_D10: B1.E11(DQ10A) ; off-sheet DDR0_D10
DDR0_D11: B1.F11(DQ11A) ; off-sheet DDR0_D11
DDR0_D12: B1.F9(DQ12A) ; off-sheet DDR0_D12
DDR0_D13: B1.E9(DQ13A) ; off-sheet DDR0_D13
DDR0_D14: B1.C9(DQ14A) ; off-sheet DDR0_D14
DDR0_D15: B1.B9(DQ15A) ; off-sheet DDR0_D15
DDR0_D16: B1.AA2(DQ0_B) ; off-sheet DDR0_D16
DDR0_D17: B1.AA4(DQ7_B) B1.Y2(DQ1_B) ; off-sheet DDR0_D17
DDR0_D18: B1.U4(DQ4_B) B1.V2(DQ2_B) ; off-sheet DDR0_D18
DDR0_D19: B1.U2(DQ3_B) ; off-sheet DDR0_D19
DDR0_D21: B1.V4(DQ5_B) ; off-sheet DDR0_D21
DDR0_D22: B1.Y4(DQ6_B) ; off-sheet DDR0_D22
DDR0_D24: B1.AA11(DQ8_B) ; off-sheet DDR0_D24
DDR0_D25: B1.Y11(DQ9_B) ; off-sheet DDR0_D25
DDR0_D26: B1.V11(DQ10_B) ; off-sheet DDR0_D26
DDR0_D27: B1.U11(DQ11_B) ; off-sheet DDR0_D27
DDR0_D28: B1.U9(DQ12_B) ; off-sheet DDR0_D28
DDR0_D29: B1.V9(DQ13_B) ; off-sheet DDR0_D29
DDR0_D30: B1.Y9(DQ14_B) ; off-sheet DDR0_D30
DDR0_D31: B1.AA9(DQ15_B) ; off-sheet DDR0_D31
DDR0_DM0: B1.C3(DM10A) ; off-sheet DDR0_DM0
DDR0_DM1: B1.C10(DM11A) ; off-sheet DDR0_DM1
DDR0_DM2: B1.Y3(DM10_B) ; off-sheet DDR0_DM2
DDR0_DM3: B1.Y10(DM11_B) ; off-sheet DDR0_DM3
DDR0_DQS0_N: B1.E3(DQS0_C_A) ; off-sheet DDR0_DQS0_N
DDR0_DQS0_P: B1.D3(DQS0_TA) ; off-sheet DDR0_DQS0_P
DDR0_DQS1_N: B1.E10(DQS1_C_A) ; off-sheet DDR0_DQS1_N
DDR0_DQS1_P: B1.D10(DQS1_TA) ; off-sheet DDR0_DQS1_P
DDR0_DQS2_N: B1.V3(DQS0_CB) ; off-sheet DDR0_DQS2_N
DDR0_DQS2_P: B1.W3(DQS0_TB) ; off-sheet DDR0_DQS2_P
DDR0_DQS3_N: B1.V10(DQS1_CB) ; off-sheet DDR0_DQS3_N
DDR0_DQS3_P: B1.W10(DQS1_TB) ; off-sheet DDR0_DQS3_P
DDR0_RST: B1.T11(RESET) ; off-sheet DDR0_RST
NetB1_A5: B1.A5(ZQ0) R43.2
NetB1_A8: B1.A8(ZQ1) R44.2
NetB1_G2: B1.G2(ODT_A) R46.1
NetB1_T2: B1.T2(ODT_B) R45.1

Not connected (* = marked no-connect by the designer): B1 A1(DNU_1)* A2(DNU_2)* A11(DNU_3)* A12(DNU_4)* AA1(DNU_7)* AA12(DNU_8)* AB1(DNU_9)* AB2(DNU_10)* AB11(DNU_11)* AB12(DNU_12)* B1(DNU_5)* B12(DNU_6)* G11(NC_1)* K5(NC_2)* K8(NC_3)* N5(NC_4)* N8(NC_5)*

### Notes on the sheet
- THIS DOCUMENT AND THE DATA DISCLOSED HEREIN OR
- HEREWITH IS THE PROPERTY OF ALTIUM LIMITED AND MAY
- DWG NO:
- REVISION
- REV:
- DESCRIPTION
- DATE
- APPROVED
- BE FREELY DISTRIBUTED IN WHOLE. NO RIGHTS ARE
- RESERVED OR EXPRESS OR IMPLIED WARANTEE GIVEN.
- ENG:
- APPROVALS
- PROJECT
- DSN:
- CHK:
- REFERENCE DOCUMENTS
- PROJECT REVISION:
- TITLE
- DOCUMENT REVISION:
- DESIGN ITEM:
- BOM:
- FAB DWG:
- PCB DWG:
- ASSY DWG:
- SCALE:
- A3
- SIZE
- CAGE CODE
- FILE NAME
- DWG NO.
- SHEET
- OF
- REV

### Library data of the parts
B1 = RS512M32LZ4D2ANP-75BT: BGA-200 New Arrivals ROHS; Manufacturer_Name: Rayson; Geometry.Height: 1mm; Manufacturer_Part_Number: RS512M32LZ4D2ANP-75BT; Mouser Part Number: *; Mouser Price/Stock: *; Arrow Part Number: *; Arrow Price/Stock: *; Datasheet Link: https://www.szrayson.com/uploadfiles/2020/05/20200519174828010.pdf
C164-C168 C171 C175-C180 = C1005X7R1H104M050BB: Description; Manufacturer_Name: TDK; Copyright: Copyright (C) 2025 Ultra Librarian. All rights reserved.; Manufacturer_Part_Number: C1005X7R1H104M050BB
C169 C173 = CL05A106MQ5NUNC: 10 ÂµF Â±20% 6.3V Ceramic Capacitor X5R 0402 (1005 Metric); MF: Samsung; SnapEDA_Link: https://www.snapeda.com/parts/CL05A106MQ5NUNC/Samsung/view-part/?ref=snap; Package: SMD-2 Samsung; Value: *; MP: CL05A106MQ5NUNC; Check_prices: https://www.snapeda.com/parts/CL05A106MQ5NUNC/Samsung/view-part/?ref=eda
C170 C174 = 0402ZD105KAT4A: 1 ÂµF Â±10% 10V Ceramic Capacitor X5R 0402 (1005 Metric); MF: AVX; SnapEDA_Link: https://www.snapeda.com/parts/0402ZD105KAT4A/AVX/view-part/?ref=snap; Package: 1005 AVX; Value: *; MP: 0402ZD105KAT4A; Check_prices: https://www.snapeda.com/parts/0402ZD105KAT4A/AVX/view-part/?ref=eda
C172 C181 = CKG57NX7S1H226M500JJ: 22ÂµF Â±20% 50V Ceramic Capacitor X7S Stacked SMD, 2 J-Lead; MP: CKG57NX7S1H226M500JJ; Package: None; Availability: Unavailable; Price: None; Value: *
R43 R44 = ERA6AED241V: Value: *; Availability: Unavailable; Price: None; Package: None; MP: ERA6AED241V
R45 R46 = CRCW06031K00FKECC: 1 kOhms Â±1% 0.1W, 1/10W Chip Resistor 0603 (1608 Metric) - Thick Film; MF: Vishay; SnapEDA_Link: https://www.snapeda.com/parts/CRCW06031K00FKECC/Vishay/view-part/?ref=snap; Package: 0603-2 Vishay; Value: *; MP: CRCW06031K00FKECC; Check_prices: https://www.snapeda.com/parts/CRCW06031K00FKECC/Vishay/view-part/?ref=eda

## Sheet LPDDR4 SDRAM_2.SchDoc
size 420 x 297 mm; SheetNumber: 13; SheetTotal: 26
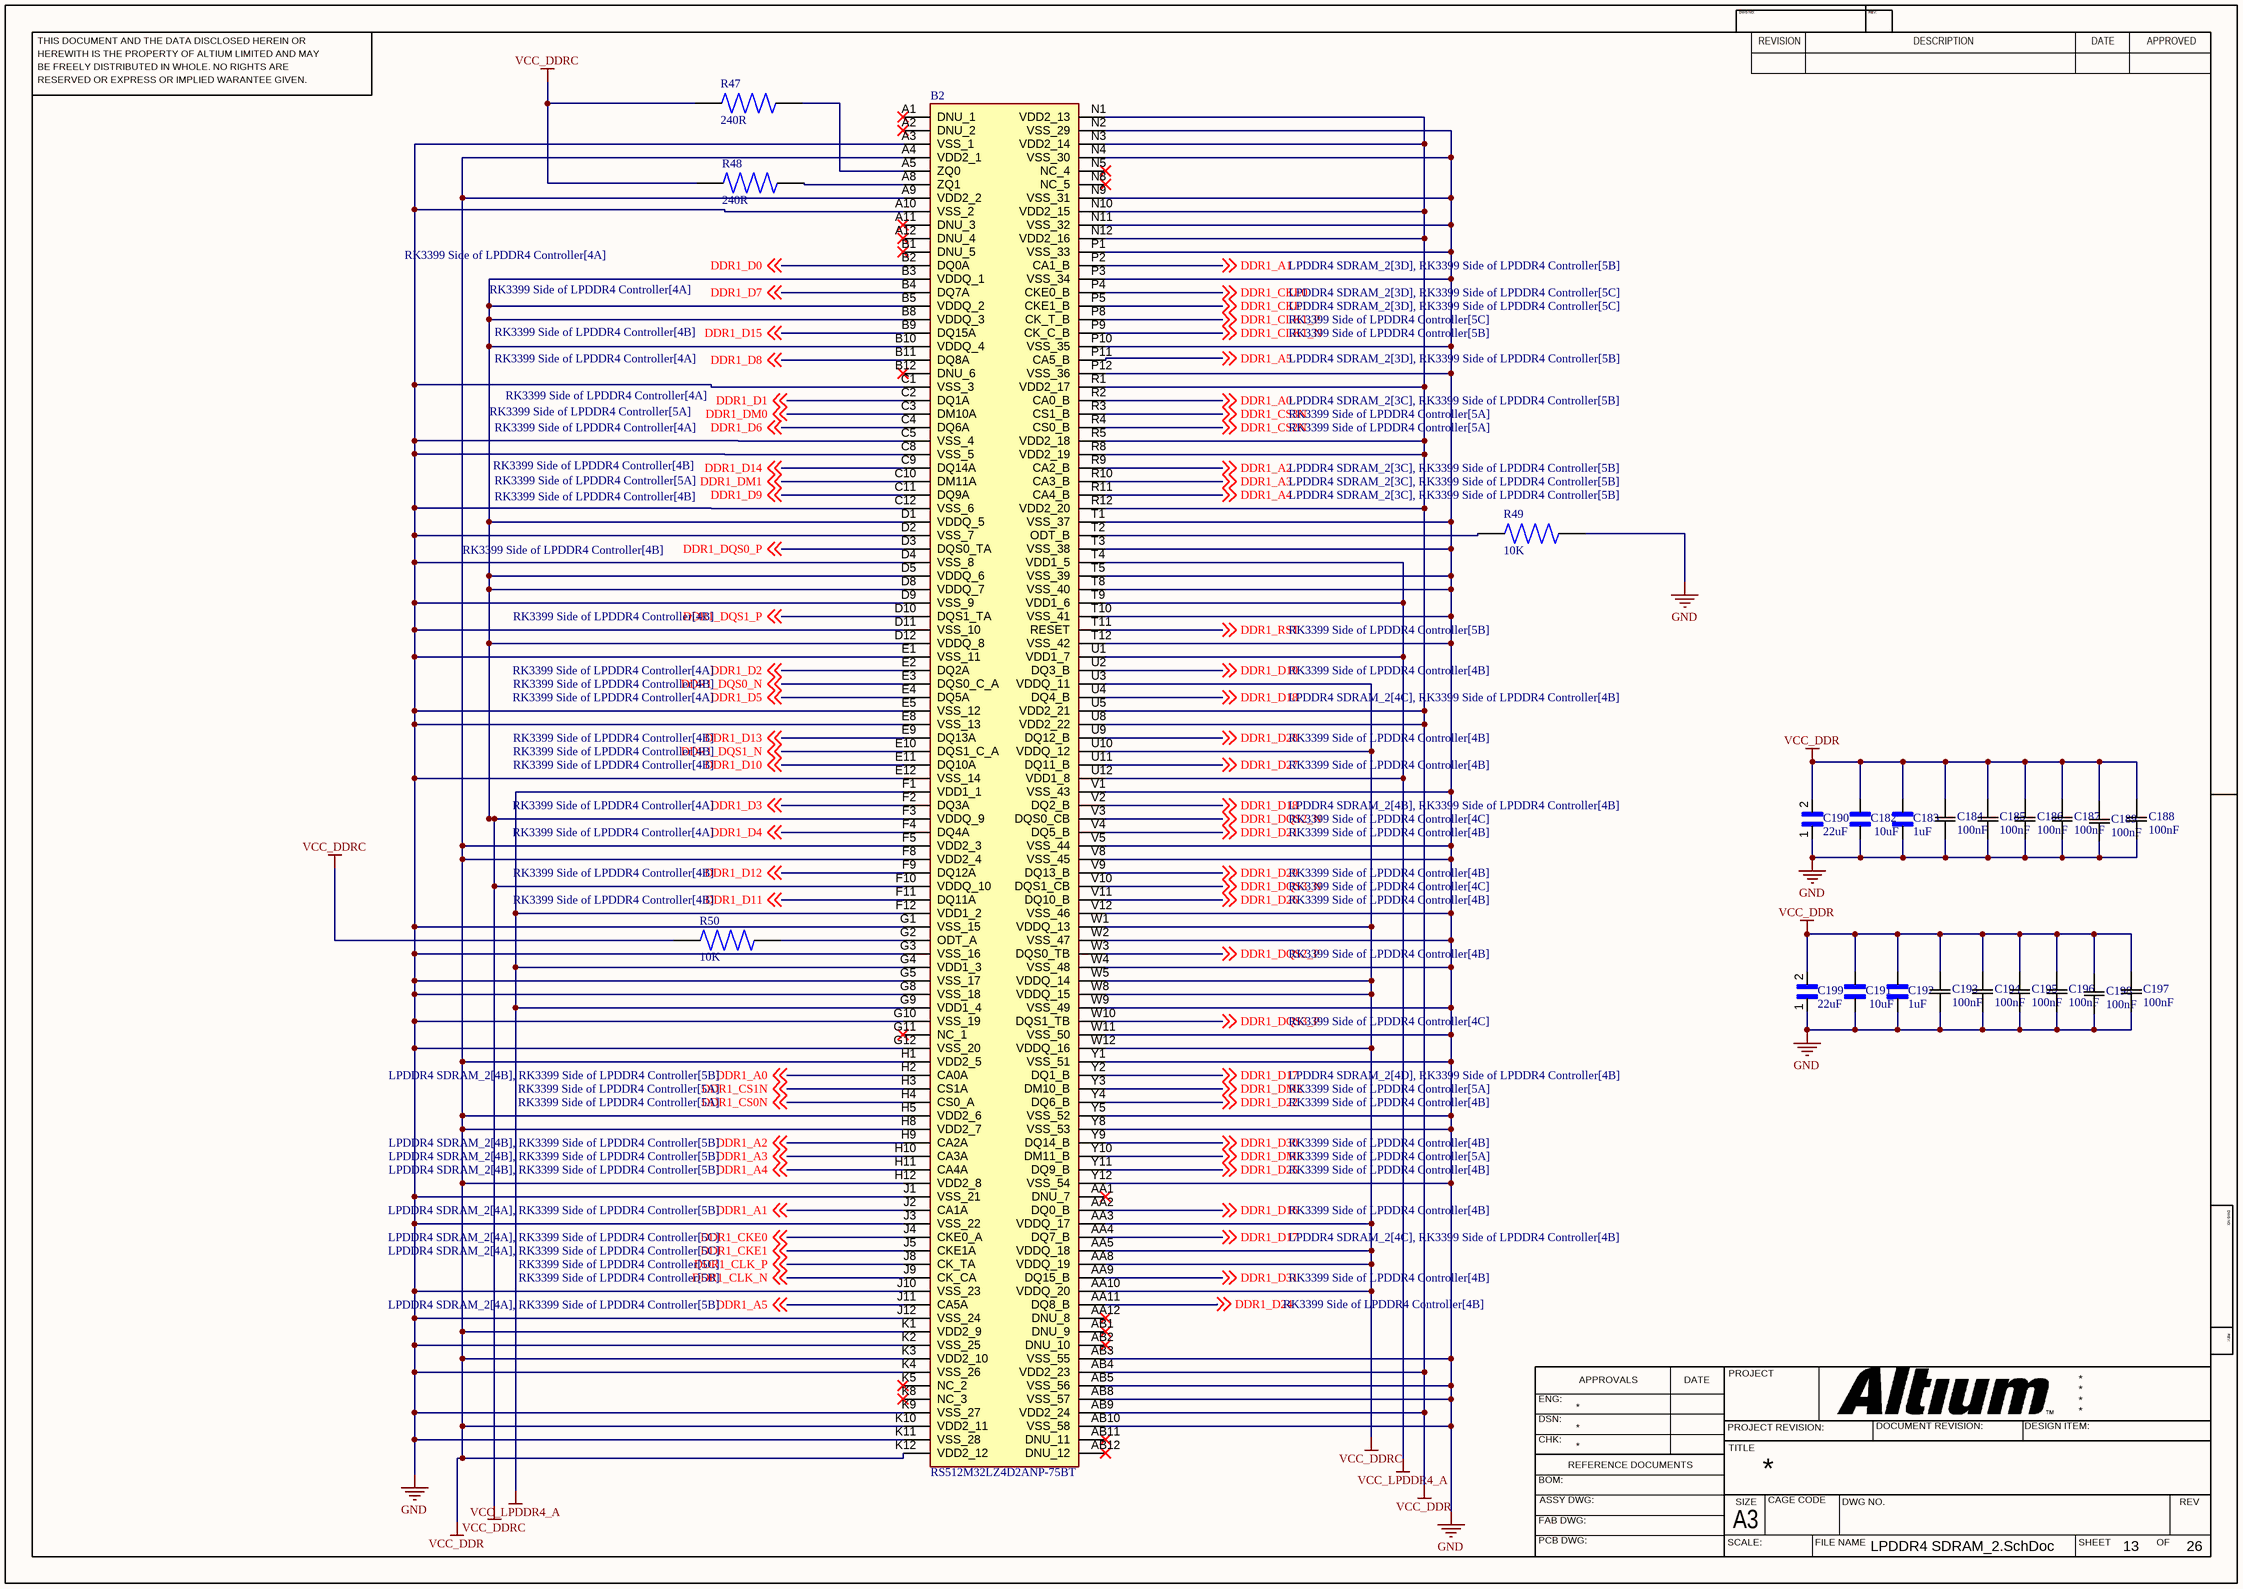
[diagram p12: LPDDR4 SDRAM_2.SchDoc]

### Parts
B2  RS512M32LZ4D2ANP-75BT  [BGA200C65P12X22_1000X1500X100]
C182  10uF  [CAPC1005X70N]
C183  1uF  [CAPC1005X56N]
C184  100nF  [CAP_1005_TDK]
C185  100nF  [CAP_1005_TDK]
C186  100nF  [CAP_1005_TDK]
C187  100nF  [CAP_1005_TDK]
C188  100nF  [CAP_1005_TDK]
C189  100nF  [CAP_1005_TDK]
C190  22uF  [CAPC6050X550N]
C191  10uF  [CAPC1005X70N]
C192  1uF  [CAPC1005X56N]
C193  100nF  [CAP_1005_TDK]
C194  100nF  [CAP_1005_TDK]
C195  100nF  [CAP_1005_TDK]
C196  100nF  [CAP_1005_TDK]
C197  100nF  [CAP_1005_TDK]
C198  100nF  [CAP_1005_TDK]
C199  22uF  [CAPC6050X550N]
R47  240R  [RESC1608X50N]
R48  240R  [RESC1608X50N]
R49  10K  [RESC1608X55N]
R50  10K  [RESC1608X55N]

### Nets
GND: B2.A3(VSS_1) B2.A10(VSS_2) B2.AB3(VSS_55) B2.AB5(VSS_56) B2.AB8(VSS_57) B2.AB10(VSS_58) B2.C1(VSS_3) B2.C5(VSS_4) B2.C8(VSS_5) B2.C12(VSS_6) B2.D2(VSS_7) B2.D4(VSS_8) B2.D9(VSS_9) B2.D11(VSS_10) B2.E1(VSS_11) B2.E5(VSS_12) B2.E8(VSS_13) B2.E12(VSS_14) B2.G1(VSS_15) B2.G3(VSS_16) B2.G5(VSS_17) B2.G8(VSS_18) B2.G10(VSS_19) B2.G12(VSS_20) B2.J1(VSS_21) B2.J3(VSS_22) B2.J10(VSS_23) B2.J12(VSS_24) B2.K2(VSS_25) B2.K4(VSS_26) B2.K9(VSS_27) B2.K11(VSS_28) B2.N2(VSS_29) B2.N4(VSS_30) B2.N9(VSS_31) B2.N11(VSS_32) B2.P1(VSS_33) B2.P3(VSS_34) B2.P10(VSS_35) B2.P12(VSS_36) B2.T1(VSS_37) B2.T3(VSS_38) B2.T5(VSS_39) B2.T8(VSS_40) B2.T10(VSS_41) B2.T12(VSS_42) B2.V1(VSS_43) B2.V5(VSS_44) B2.V8(VSS_45) B2.V12(VSS_46) B2.W2(VSS_47) B2.W4(VSS_48) B2.W9(VSS_49) B2.W11(VSS_50) B2.Y1(VSS_51) B2.Y5(VSS_52) B2.Y8(VSS_53) B2.Y12(VSS_54) C182.1 C183.1 C184.1 C185.1 C186.1 C187.1 C188.1 C189.1 C190.1 C191.1 C192.1 C193.1 C194.1 C195.1 C196.1 C197.1 C198.1 C199.1 R49.2
VCC_DDR: B2.A4(VDD2_1) B2.A9(VDD2_2) B2.AB4(VDD2_23) B2.AB9(VDD2_24) B2.F5(VDD2_3) B2.F8(VDD2_4) B2.H1(VDD2_5) B2.H5(VDD2_6) B2.H8(VDD2_7) B2.H12(VDD2_8) B2.K1(VDD2_9) B2.K3(VDD2_10) B2.K10(VDD2_11) B2.K12(VDD2_12) B2.N1(VDD2_13) B2.N3(VDD2_14) B2.N10(VDD2_15) B2.N12(VDD2_16) B2.R1(VDD2_17) B2.R5(VDD2_18) B2.R8(VDD2_19) B2.R12(VDD2_20) B2.U5(VDD2_21) B2.U8(VDD2_22) C182.2 C183.2 C184.2 C185.2 C186.2 C187.2 C188.2 C189.2 C190.2 C191.2 C192.2 C193.2 C194.2 C195.2 C196.2 C197.2 C198.2 C199.2
VCC_DDRC: B2.AA3(VDDQ_17) B2.AA5(VDDQ_18) B2.AA8(VDDQ_19) B2.AA10(VDDQ_20) B2.B3(VDDQ_1) B2.B5(VDDQ_2) B2.B8(VDDQ_3) B2.B10(VDDQ_4) B2.D1(VDDQ_5) B2.D5(VDDQ_6) B2.D8(VDDQ_7) B2.D12(VDDQ_8) B2.F3(VDDQ_9) B2.F10(VDDQ_10) B2.U3(VDDQ_11) B2.U10(VDDQ_12) B2.W1(VDDQ_13) B2.W5(VDDQ_14) B2.W8(VDDQ_15) B2.W12(VDDQ_16) R47.1 R48.1 R50.2
VCC_LPDDR4_A: B2.F1(VDD1_1) B2.F12(VDD1_2) B2.G4(VDD1_3) B2.G9(VDD1_4) B2.T4(VDD1_5) B2.T9(VDD1_6) B2.U1(VDD1_7) B2.U12(VDD1_8)
DDR1_A0: B2.H2(CA0A) B2.R2(CA0_B) ; off-sheet DDR1_A0
DDR1_A1: B2.J2(CA1A) B2.P2(CA1_B) ; off-sheet DDR1_A1
DDR1_A2: B2.H9(CA2A) B2.R9(CA2_B) ; off-sheet DDR1_A2
DDR1_A3: B2.H10(CA3A) B2.R10(CA3_B) ; off-sheet DDR1_A3
DDR1_A4: B2.H11(CA4A) B2.R11(CA4_B) ; off-sheet DDR1_A4
DDR1_A5: B2.J11(CA5A) B2.P11(CA5_B) ; off-sheet DDR1_A5
DDR1_CKE0: B2.J4(CKE0_A) B2.P4(CKE0_B) ; off-sheet DDR1_CKE0
DDR1_CKE1: B2.J5(CKE1A) B2.P5(CKE1_B) ; off-sheet DDR1_CKE1
DDR1_CLK1_N: B2.P9(CK_C_B) ; off-sheet DDR1_CLK1_N
DDR1_CLK1_P: B2.P8(CK_T_B) ; off-sheet DDR1_CLK1_P
DDR1_CLK_N: B2.J9(CK_CA) ; off-sheet DDR1_CLK_N
DDR1_CLK_P: B2.J8(CK_TA) ; off-sheet DDR1_CLK_P
DDR1_CS0N: B2.H4(CS0_A) ; off-sheet DDR1_CS0N
DDR1_CS1N: B2.H3(CS1A) ; off-sheet DDR1_CS1N
DDR1_CS2N: B2.R4(CS0_B) ; off-sheet DDR1_CS2N
DDR1_CS3N: B2.R3(CS1_B) ; off-sheet DDR1_CS3N
DDR1_D0: B2.B2(DQ0A) ; off-sheet DDR1_D0
DDR1_D1: B2.C2(DQ1A) ; off-sheet DDR1_D1
DDR1_D2: B2.E2(DQ2A) ; off-sheet DDR1_D2
DDR1_D3: B2.F2(DQ3A) ; off-sheet DDR1_D3
DDR1_D4: B2.F4(DQ4A) ; off-sheet DDR1_D4
DDR1_D5: B2.E4(DQ5A) ; off-sheet DDR1_D5
DDR1_D6: B2.C4(DQ6A) ; off-sheet DDR1_D6
DDR1_D7: B2.B4(DQ7A) ; off-sheet DDR1_D7
DDR1_D8: B2.B11(DQ8A) ; off-sheet DDR1_D8
DDR1_D9: B2.C11(DQ9A) ; off-sheet DDR1_D9
DDR1_D10: B2.E11(DQ10A) ; off-sheet DDR1_D10
DDR1_D11: B2.F11(DQ11A) ; off-sheet DDR1_D11
DDR1_D12: B2.F9(DQ12A) ; off-sheet DDR1_D12
DDR1_D13: B2.E9(DQ13A) ; off-sheet DDR1_D13
DDR1_D14: B2.C9(DQ14A) ; off-sheet DDR1_D14
DDR1_D15: B2.B9(DQ15A) ; off-sheet DDR1_D15
DDR1_D16: B2.AA2(DQ0_B) ; off-sheet DDR1_D16
DDR1_D17: B2.AA4(DQ7_B) B2.Y2(DQ1_B) ; off-sheet DDR1_D17
DDR1_D18: B2.U4(DQ4_B) B2.V2(DQ2_B) ; off-sheet DDR1_D18
DDR1_D19: B2.U2(DQ3_B) ; off-sheet DDR1_D19
DDR1_D21: B2.V4(DQ5_B) ; off-sheet DDR1_D21
DDR1_D22: B2.Y4(DQ6_B) ; off-sheet DDR1_D22
DDR1_D24: B2.AA11(DQ8_B) ; off-sheet DDR1_D24
DDR1_D25: B2.Y11(DQ9_B) ; off-sheet DDR1_D25
DDR1_D26: B2.V11(DQ10_B) ; off-sheet DDR1_D26
DDR1_D27: B2.U11(DQ11_B) ; off-sheet DDR1_D27
DDR1_D28: B2.U9(DQ12_B) ; off-sheet DDR1_D28
DDR1_D29: B2.V9(DQ13_B) ; off-sheet DDR1_D29
DDR1_D30: B2.Y9(DQ14_B) ; off-sheet DDR1_D30
DDR1_D31: B2.AA9(DQ15_B) ; off-sheet DDR1_D31
DDR1_DM0: B2.C3(DM10A) ; off-sheet DDR1_DM0
DDR1_DM1: B2.C10(DM11A) ; off-sheet DDR1_DM1
DDR1_DM2: B2.Y3(DM10_B) ; off-sheet DDR1_DM2
DDR1_DM3: B2.Y10(DM11_B) ; off-sheet DDR1_DM3
DDR1_DQS0_N: B2.E3(DQS0_C_A) ; off-sheet DDR1_DQS0_N
DDR1_DQS0_P: B2.D3(DQS0_TA) ; off-sheet DDR1_DQS0_P
DDR1_DQS1_N: B2.E10(DQS1_C_A) ; off-sheet DDR1_DQS1_N
DDR1_DQS1_P: B2.D10(DQS1_TA) ; off-sheet DDR1_DQS1_P
DDR1_DQS2_N: B2.V3(DQS0_CB) ; off-sheet DDR1_DQS2_N
DDR1_DQS2_P: B2.W3(DQS0_TB) ; off-sheet DDR1_DQS2_P
DDR1_DQS3_N: B2.V10(DQS1_CB) ; off-sheet DDR1_DQS3_N
DDR1_DQS3_P: B2.W10(DQS1_TB) ; off-sheet DDR1_DQS3_P
DDR1_RST: B2.T11(RESET) ; off-sheet DDR1_RST
NetB2_A5: B2.A5(ZQ0) R47.2
NetB2_A8: B2.A8(ZQ1) R48.2
NetB2_G2: B2.G2(ODT_A) R50.1
NetB2_T2: B2.T2(ODT_B) R49.1

Not connected (* = marked no-connect by the designer): B2 A1(DNU_1)* A2(DNU_2)* A11(DNU_3)* A12(DNU_4)* AA1(DNU_7)* AA12(DNU_8)* AB1(DNU_9)* AB2(DNU_10)* AB11(DNU_11)* AB12(DNU_12)* B1(DNU_5)* B12(DNU_6)* G11(NC_1)* K5(NC_2)* K8(NC_3)* N5(NC_4)* N8(NC_5)*

### Notes on the sheet
- THIS DOCUMENT AND THE DATA DISCLOSED HEREIN OR
- HEREWITH IS THE PROPERTY OF ALTIUM LIMITED AND MAY
- DWG NO:
- REVISION
- REV:
- DESCRIPTION
- DATE
- APPROVED
- BE FREELY DISTRIBUTED IN WHOLE. NO RIGHTS ARE
- RESERVED OR EXPRESS OR IMPLIED WARANTEE GIVEN.
- ENG:
- APPROVALS
- PROJECT
- DSN:
- CHK:
- REFERENCE DOCUMENTS
- PROJECT REVISION:
- TITLE
- DOCUMENT REVISION:
- DESIGN ITEM:
- BOM:
- FAB DWG:
- PCB DWG:
- ASSY DWG:
- SCALE:
- A3
- SIZE
- CAGE CODE
- FILE NAME
- DWG NO.
- SHEET
- OF
- REV

### Library data of the parts
B2 = RS512M32LZ4D2ANP-75BT: as B1 on sheet LPDDR4 SDRAM_1; Manufacturer_Part_Number: RS512M32LZ4D2ANP-75BT; Mouser Part Number: *; Mouser Price/Stock: *; Arrow Part Number: *; Arrow Price/Stock: *; Datasheet Link: https://www.szrayson.com/uploadfiles/2020/05/20200519174828010.pdf
C182 C191 = CL05A106MQ5NUNC: as C169 on sheet LPDDR4 SDRAM_1; SnapEDA_Link: https://www.snapeda.com/parts/CL05A106MQ5NUNC/Samsung/view-part/?ref=snap; Package: SMD-2 Samsung; Value: *; MP: CL05A106MQ5NUNC; Check_prices: https://www.snapeda.com/parts/CL05A106MQ5NUNC/Samsung/view-part/?ref=eda
C183 C192 = 0402ZD105KAT4A: as C170 on sheet LPDDR4 SDRAM_1; SnapEDA_Link: https://www.snapeda.com/parts/0402ZD105KAT4A/AVX/view-part/?ref=snap; Package: 1005 AVX; Value: *; MP: 0402ZD105KAT4A; Check_prices: https://www.snapeda.com/parts/0402ZD105KAT4A/AVX/view-part/?ref=eda
C184-C189 C193-C198 = C1005X7R1H104M050BB: Description; Manufacturer_Name: TDK; Copyright: Copyright (C) 2025 Ultra Librarian. All rights reserved.; Manufacturer_Part_Number: C1005X7R1H104M050BB
C190 C199 = CKG57NX7S1H226M500JJ: as C172 on sheet LPDDR4 SDRAM_1; MP: CKG57NX7S1H226M500JJ; Package: None; Availability: Unavailable; Price: None; Value: *
R47 R48 = ERA6AED241V: Value: *; Availability: Unavailable; Price: None; Package: None; MP: ERA6AED241V
R49 R50 = CRCW06031K00FKECC: as R45 on sheet LPDDR4 SDRAM_1; SnapEDA_Link: https://www.snapeda.com/parts/CRCW06031K00FKECC/Vishay/view-part/?ref=snap; Package: 0603-2 Vishay; Value: *; MP: CRCW06031K00FKECC; Check_prices: https://www.snapeda.com/parts/CRCW06031K00FKECC/Vishay/view-part/?ref=eda

## Sheet EMMC with rk399.SchDoc
size A4; SheetNumber: 14; SheetTotal: 26
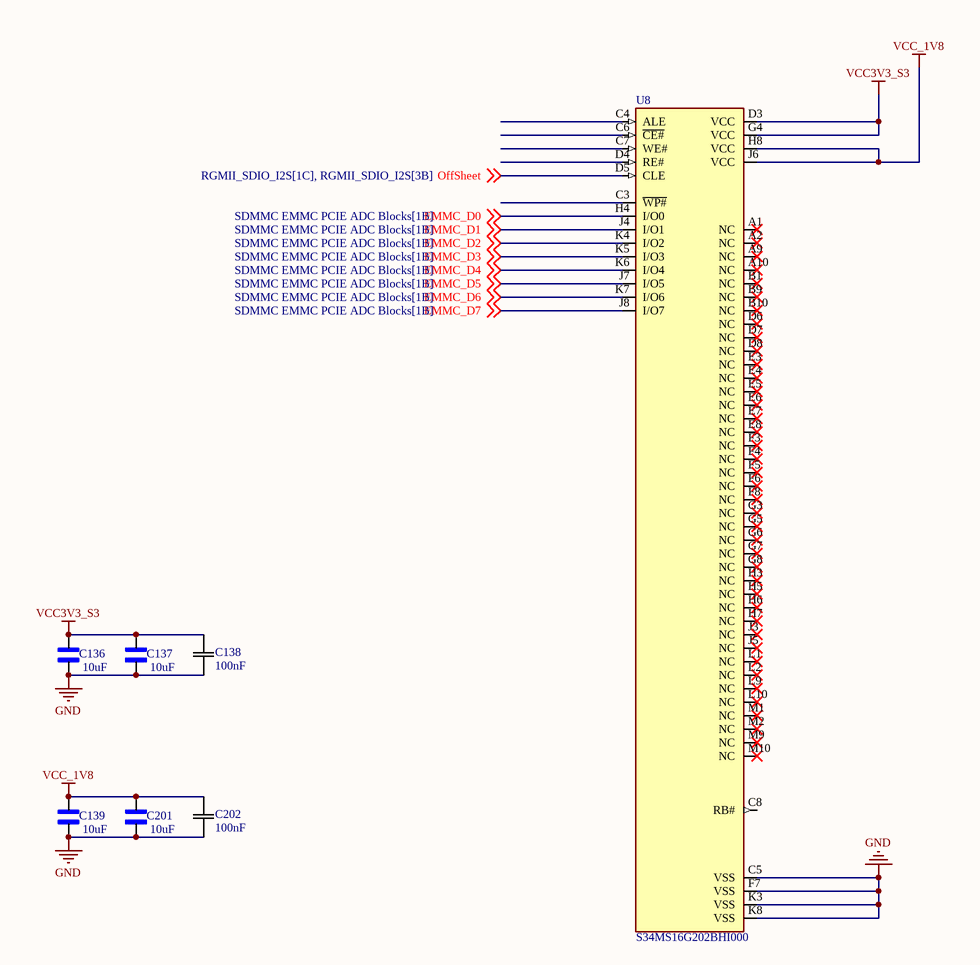
[diagram p13: EMMC with rk399.SchDoc]

### Parts
C136  10uF  [CAPC1005X70N]
C137  10uF  [CAPC1005X70N]
C138  100nF  [CAP_1005_TDK]
C139  10uF  [CAPC1005X70N]
C201  10uF  [CAPC1005X70N]
C202  100nF  [CAP_1005_TDK]
U8  S34MS16G202BHI000  [BGA63C80P12X10_1100X900X120]

### Nets
GND: C136.1 C137.1 C138.2 C139.1 C201.1 C202.2 U8.C5(VSS) U8.F7(VSS) U8.K3(VSS) U8.K8(VSS)
VCC3V3_S3: C136.2 C137.2 C138.1 U8.D3(VCC) U8.G4(VCC)
VCC_1V8: C139.2 C201.2 C202.1 U8.H8(VCC) U8.J6(VCC)
EMMC_D0: U8.H4(I/O0) ; off-sheet EMMC_D0
EMMC_D1: U8.J4(I/O1) ; off-sheet EMMC_D1
EMMC_D2: U8.K4(I/O2) ; off-sheet EMMC_D2
EMMC_D3: U8.K5(I/O3) ; off-sheet EMMC_D3
EMMC_D4: U8.K6(I/O4) ; off-sheet EMMC_D4
EMMC_D5: U8.J7(I/O5) ; off-sheet EMMC_D5
EMMC_D6: U8.K7(I/O6) ; off-sheet EMMC_D6
EMMC_D7: U8.J8(I/O7) ; off-sheet EMMC_D7
OffSheet: U8.D5(CLE) ; off-sheet OffSheet

Not connected (* = marked no-connect by the designer): U8 A1(NC)* A2(NC)* A9(NC)* A10(NC)* B1(NC)* B9(NC)* B10(NC)* C3(~{WP#}) C4(ALE) C6(~{CE#}) C7(WE#) C8(RB#) D4(RE#) D6(NC)* D7(NC)* D8(NC)* E3(NC)* E4(NC)* E5(NC)* E6(NC)* E7(NC)* E8(NC)* F3(NC)* F4(NC)* F5(NC)* F6(NC)* F8(NC)* G3(NC)* G5(NC)* G6(NC)* G7(NC)* G8(NC)* H3(NC)* H5(NC)* H6(NC)* H7(NC)* J3(NC)* J5(NC)* L1(NC)* L2(NC)* L9(NC)* L10(NC)* M1(NC)* M2(NC)* M9(NC)* M10(NC)*

### Library data of the parts
C136 C137 C139 C201 = CL05A106MQ5NUNC: as C169 on sheet LPDDR4 SDRAM_1; SnapEDA_Link: https://www.snapeda.com/parts/CL05A106MQ5NUNC/Samsung/view-part/?ref=snap; Package: SMD-2 Samsung; Value: *; MP: CL05A106MQ5NUNC; Check_prices: https://www.snapeda.com/parts/CL05A106MQ5NUNC/Samsung/view-part/?ref=eda
C138 C202 = C1005X7R1H104M050BB: Description; Manufacturer_Name: TDK; Copyright: Copyright (C) 2025 Ultra Librarian. All rights reserved.; Manufacturer_Part_Number: C1005X7R1H104M050BB
U8 = S34MS16G202BHI000: FLASH - NAND Memory IC 16Gb (4G x 4) Parallel 45 ns 63-BGA (11x9); MF: Cypress Semiconductor; SnapEDA_Link: https://www.snapeda.com/parts/S34MS16G202BHI000/Infineon/view-part/?ref=snap; Package: BGA-63 Cypress Semiconductor; Value: *; MP: S34MS16G202BHI000; Check_prices: https://www.snapeda.com/parts/S34MS16G202BHI000/Infineon/view-part/?ref=eda

## Sheet WIFI_MODULE.SchDoc
size A4; SheetNumber: 15; SheetTotal: 26
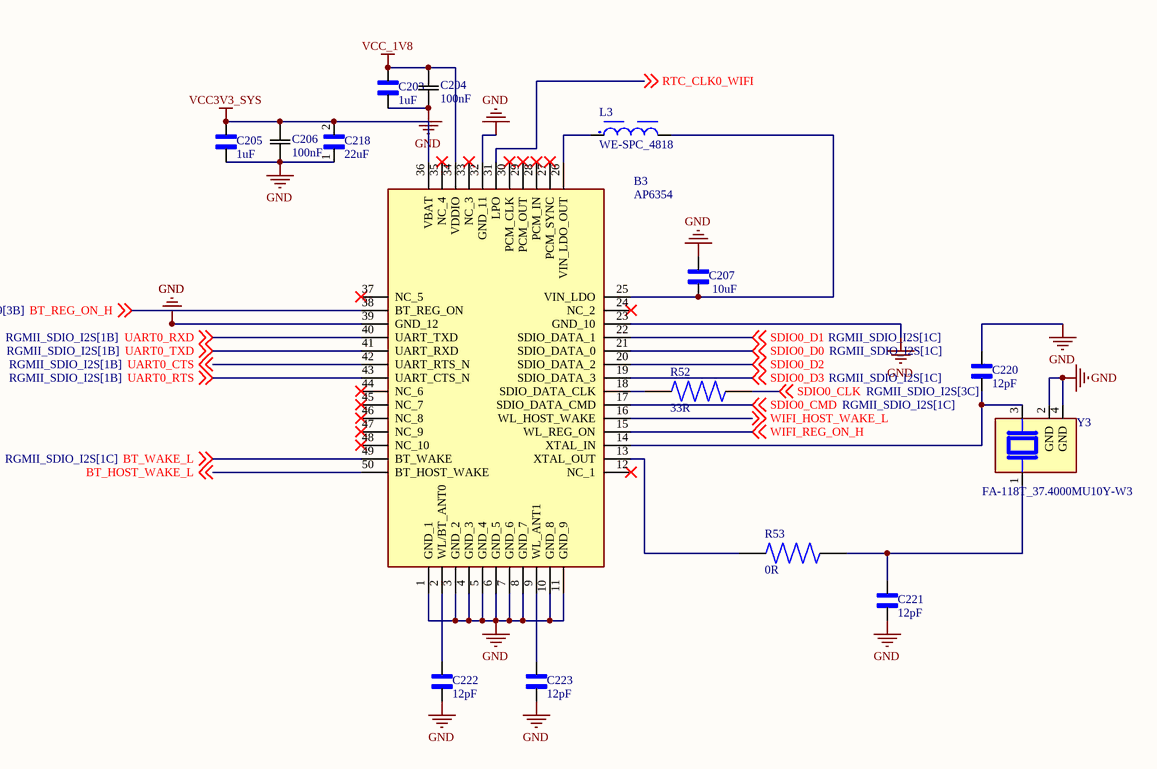
[diagram p14: WIFI_MODULE.SchDoc]

### Parts
B3  AP6354  [AP6354]
C203  1uF  [CAPC1005X56N]
C204  100nF  [CAP_1005_TDK]
C205  1uF  [CAPC1005X56N]
C206  100nF  [CAP_1005_TDK]
C207  10uF  [CAPC1005X70N]
C218  22uF  [CAPC6050X550N]
C220  12pF  [CAPC1608X90]
C221  12pF  [CAPC1608X90]
C222  12pF  [CAPC1608X90]
C223  12pF  [CAPC1608X90]
L3  WE-SPC_4818  [WE-SPC_4818]
R52  33R  [RES_ERA6AHD330V]
R53  0R  [RES_ERJH6G0R00V]
Y3  FA-118T_37.4000MU10Y-W3  [XTAL_FA-118T_37.4000MU10Y-W3]

### Nets
GND: B3.1(GND_1) B3.3(GND_2) B3.4(GND_3) B3.5(GND_4) B3.6(GND_5) B3.7(GND_6) B3.8(GND_7) B3.10(GND_8) B3.11(GND_9) B3.23(GND_10) B3.32(GND_11) B3.39(GND_12) C203.1 C204.1 C205.1 C206.1 C207.2 C218.1 C220.2 C221.1 C222.2 C223.2 Y3.2(GND) Y3.4(GND)
VCC3V3_SYS: B3.36(VBAT) C205.2 C206.2 C218.2
VCC_1V8: B3.34(VDDIO) C203.2 C204.2
BT_HOST_WAKE_L: B3.50(BT_HOST_WAKE) ; off-sheet BT_HOST_WAKE_L
BT_REG_ON_H: B3.38(BT_REG_ON) ; off-sheet BT_REG_ON_H
BT_WAKE_L: B3.49(BT_WAKE) ; off-sheet BT_WAKE_L
RTC_CLK0_WIFI: B3.31(LPO) ; off-sheet RTC_CLK0_WIFI
SDIO0_CLK: R52.2 ; off-sheet SDIO0_CLK
SDIO0_CMD: B3.17(SDIO_DATA_CMD) ; off-sheet SDIO0_CMD
SDIO0_D0: B3.21(SDIO_DATA_0) ; off-sheet SDIO0_D0
SDIO0_D1: B3.22(SDIO_DATA_1) ; off-sheet SDIO0_D1
SDIO0_D2: B3.20(SDIO_DATA_2) ; off-sheet SDIO0_D2
SDIO0_D3: B3.19(SDIO_DATA_3) ; off-sheet SDIO0_D3
UART0_CTS: B3.42(UART_RTS_N) ; off-sheet UART0_CTS
UART0_RTS: B3.43(UART_CTS_N) ; off-sheet UART0_RTS
UART0_RXD: B3.40(UART_TXD) ; off-sheet UART0_RXD
UART0_TXD: B3.41(UART_RXD) ; off-sheet UART0_TXD
WIFI_HOST_WAKE_L: B3.16(WL_HOST_WAKE) ; off-sheet WIFI_HOST_WAKE_L
WIFI_REG_ON_H: B3.15(WL_REG_ON) ; off-sheet WIFI_REG_ON_H
NetB3_2: B3.2(WL/BT_ANT0) C222.1
NetB3_9: B3.9(WL_ANT1) C223.1
NetB3_13: B3.13(XTAL_OUT) R53.1
NetB3_14: B3.14(XTAL_IN) C220.1 Y3.3
NetB3_18: B3.18(SDIO_DATA_CLK) R52.1
NetB3_25: B3.25(VIN_LDO) C207.1 L3.2
NetB3_26: B3.26(VIN_LDO_OUT) L3.1
NetC221_2: C221.2 R53.2 Y3.1

Not connected (* = marked no-connect by the designer): B3 12(NC_1)* 24(NC_2)* 27(PCM_SYNC)* 28(PCM_IN)* 29(PCM_OUT)* 30(PCM_CLK)* 33(NC_3)* 35(NC_4)* 37(NC_5)* 44(NC_6)* 45(NC_7)* 46(NC_8)* 47(NC_9)* 48(NC_10)*

### Library data of the parts
B3 = AP6354: CON; Manufacturer_Name: AMPAK; Geometry.Height: 1.6mm; Manufacturer_Part_Number: AP6354; Mouser Part Number: *; Mouser Price/Stock: *; Arrow Part Number: *; Arrow Price/Stock: *; Datasheet Link: http://www.boardcon.com/download/AP6354_datasheet.pdf
C203 C205 = 0402ZD105KAT4A: as C170 on sheet LPDDR4 SDRAM_1; SnapEDA_Link: https://www.snapeda.com/parts/0402ZD105KAT4A/AVX/view-part/?ref=snap; Package: 1005 AVX; Value: *; MP: 0402ZD105KAT4A; Check_prices: https://www.snapeda.com/parts/0402ZD105KAT4A/AVX/view-part/?ref=eda
C204 C206 = C1005X7R1H104M050BB: Description; Manufacturer_Name: TDK; Copyright: Copyright (C) 2025 Ultra Librarian. All rights reserved.; Manufacturer_Part_Number: C1005X7R1H104M050BB
C207 = CL05A106MQ5NUNC: as C169 on sheet LPDDR4 SDRAM_1; SnapEDA_Link: https://www.snapeda.com/parts/CL05A106MQ5NUNC/Samsung/view-part/?ref=snap; Package: SMD-2 Samsung; Value: *; MP: CL05A106MQ5NUNC; Check_prices: https://www.snapeda.com/parts/CL05A106MQ5NUNC/Samsung/view-part/?ref=eda
C218 = CKG57NX7S1H226M500JJ: as C172 on sheet LPDDR4 SDRAM_1; MP: CKG57NX7S1H226M500JJ; Package: None; Availability: Unavailable; Price: None; Value: *
C220-C223 = 06035J120FBSTR: 12 pF Thin Film Capacitor 50 V 0603 (1608 Metric); MF: AVX; SnapEDA_Link: https://www.snapeda.com/parts/06035J120FBSTR/AVX/view-part/?ref=snap; Package: 0603-2 AVX; Value: *; MP: 06035J120FBSTR; Check_prices: https://www.snapeda.com/parts/06035J120FBSTR/AVX/view-part/?ref=eda
L3 = WE-SPC_4818: 10 ÂµH Shielded Drum Core, Wirewound Inductor 900 mA 248mOhm Max 1919 (4848 Metric); MF: WÃ¼rth Elektronik; MP: 74408941100; SnapEDA_Link: https://www.snapeda.com/parts/74408941100/W%25C3%25BCrth+Elektronik+Midcom/view-part/?ref=snap; Package: 1919 WÃ¼rth Elektronik; Value: *; Check_prices: https://www.snapeda.com/parts/74408941100/W%25C3%25BCrth+Elektronik+Midcom/view-part/?ref=eda
R52 = ERA6AHD330V: Package: None; MP: ERA6AHD330V; Price: None; Value: *; Availability: Unavailable
R53 = ERJH6G0R00V: MP: ERJH6G0R00V; Value: *; Availability: Unavailable; Price: None; Package: None
Y3 = FA-118T_37.4000MU10Y-W3: Crystals XTL MHZ +/-7PPM+/-10PPM-30 85C 12PF ESR=60 OHM 250TR; MF: EPSON; MP: FA-118T 37.4000MU10Y-W3; Value: *; Price: None; Package: NON STANDARD-4 EPSON; Purchase-URL: https://pricing.snapeda.com/search/part/FA-118T 37.4000MU10Y-W3/?ref=eda; SnapEDA_Link: https://www.snapeda.com/parts/FA-118T%2037.4000MU10Y-W3/EPSON/view-part/?ref=snap; Check_prices: https://www.snapeda.com/parts/FA-118T%2037.4000MU10Y-W3/EPSON/view-part/?ref=eda; Availability: In Stock

## Sheet SD Card and Debug Uart.SchDoc
size A4; SheetNumber: 16; SheetTotal: 26
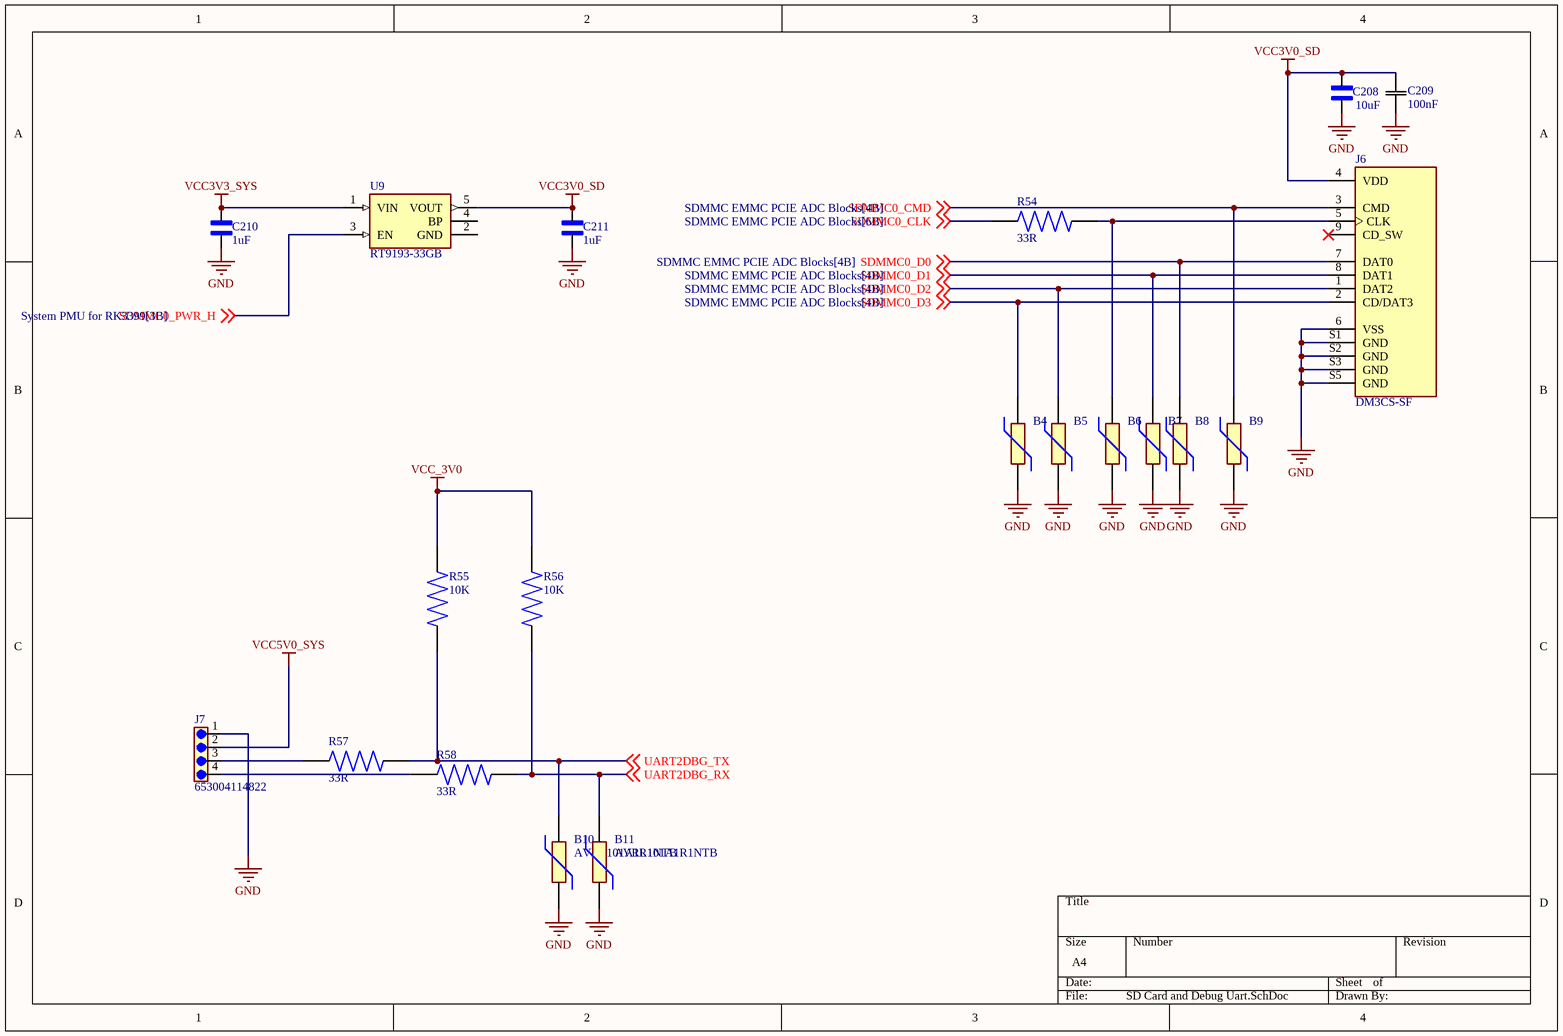
[diagram p15: SD Card and Debug Uart.SchDoc]

### Parts
B4  (no value)  [VARC1005X55N]
B5  (no value)  [VARC1005X55N]
B6  (no value)  [VARC1005X55N]
B7  (no value)  [VARC1005X55N]
B8  (no value)  [VARC1005X55N]
B9  (no value)  [VARC1005X55N]
B10  AVRL101A1R1NTB  [VARC1005X55N]
B11  AVRL101A1R1NTB  [VARC1005X55N]
C208  10uF  [CAPC1005X70N]
C209  100nF  [CAP_1005_TDK]
C210  1uF  [CAPC1005X56N]
C211  1uF  [CAPC1005X56N]
J6  DM3CS-SF  [HRS_DM3CS-SF]
J7  653004114822  [653004114822]
R54  33R  [RES_ERA6AHD330V]
R55  10K  [RES_ERA3ARB103V]
R56  10K  [RES_ERA3ARB103V]
R57  33R  [RES_ERA6AHD330V]
R58  33R  [RES_ERA6AHD330V]
U9  RT9193-33GB  [SOT94P279X129-5N]

### Nets
GND: B4.1 B5.1 B6.1 B7.1 B8.1 B9.1 B10.1 B11.1 C208.1 C209.1 C210.1 C211.1 J6.6(VSS) J6.S1(GND) J6.S2(GND) J6.S3(GND) J6.S5(GND) J7.1
VCC3V0_SD: C208.2 C209.2 C211.2 J6.4(VDD) U9.5(VOUT)
VCC3V3_SYS: C210.2 U9.1(VIN)
VCC5V0_SYS: J7.2
VCC_3V0: R55.2 R56.2
SDMMC0_CLK: R54.1 ; off-sheet SDMMC0_CLK
SDMMC0_CMD: B9.2 J6.3(CMD) ; off-sheet SDMMC0_CMD
SDMMC0_D0: B8.2 J6.7(DAT0) ; off-sheet SDMMC0_D0
SDMMC0_D1: B7.2 J6.8(DAT1) ; off-sheet SDMMC0_D1
SDMMC0_D2: B5.2 J6.1(DAT2) ; off-sheet SDMMC0_D2
SDMMC0_D3: B4.2 J6.2(CD/DAT3) ; off-sheet SDMMC0_D3
SDMMC0_PWR_H: U9.3(EN) ; off-sheet SDMMC0_PWR_H
UART2DBG_RX: B11.2 R56.1 R58.2 ; off-sheet UART2DBG_RX
UART2DBG_TX: B10.2 R55.1 R57.2 ; off-sheet UART2DBG_TX
NetB6_2: B6.2 J6.5(CLK) R54.2
NetJ7_3: J7.3 R57.1
NetJ7_4: J7.4 R58.1

Not connected (* = marked no-connect by the designer): J6 9(CD_SW)*; U9 2(GND) 4(BP)

### Library data of the parts
B4-B11 = AVRL101A1R1NTB: Chip Varistors / Ceramic Transient Voltage Suppressors, Maximum continuous voltage [DC]=10V, Capacitance = 1.1pF; Manufacturer_Name: TDK; Geometry.Height: 0.55mm; Manufacturer_Part_Number: AVRL101A1R1NTB; Mouser Part Number: 810-AVRL101A1R1NTB; Mouser Price/Stock: https://www.mouser.co.uk/ProductDetail/TDK/AVRL101A1R1NTB?qs=pr9f6yweEOGaWR8G2rllTw%3D%3D; Arrow Part Number: AVRL101A1R1NTB; Arrow Price/Stock: https://www.arrow.com/en/products/avrl101a1r1ntb/tdk?utm_currency=USD&region=europe; Datasheet Link: https://product.tdk.com/system/files/dam/doc/product/protection/voltage/varistor_ctvs/catalog/vpd_varistors_avr_en.pdf
C208 = CL05A106MQ5NUNC: as C169 on sheet LPDDR4 SDRAM_1; SnapEDA_Link: https://www.snapeda.com/parts/CL05A106MQ5NUNC/Samsung/view-part/?ref=snap; Package: SMD-2 Samsung; Value: *; MP: CL05A106MQ5NUNC; Check_prices: https://www.snapeda.com/parts/CL05A106MQ5NUNC/Samsung/view-part/?ref=eda
C209 = C1005X7R1H104M050BB: Description; Manufacturer_Name: TDK; Copyright: Copyright (C) 2025 Ultra Librarian. All rights reserved.; Manufacturer_Part_Number: C1005X7R1H104M050BB
C210 C211 = 0402ZD105KAT4A: as C170 on sheet LPDDR4 SDRAM_1; SnapEDA_Link: https://www.snapeda.com/parts/0402ZD105KAT4A/AVX/view-part/?ref=snap; Package: 1005 AVX; Value: *; MP: 0402ZD105KAT4A; Check_prices: https://www.snapeda.com/parts/0402ZD105KAT4A/AVX/view-part/?ref=eda
J6 = DM3CS-SF: 10 (8 + 2) Position Card Connector Secure Digital - microSDâ„¢ Surface Mount, Right Angle Gold; MF: Hirose Electric Co Ltd; SnapEDA_Link: https://www.snapeda.com/parts/DM3CS-SF/Hirose+Electric+Co+Ltd/view-part/?ref=snap; Package: None; Value: *; MP: DM3CS-SF; Check_prices: https://www.snapeda.com/parts/DM3CS-SF/Hirose+Electric+Co+Ltd/view-part/?ref=eda
J7 = 653004114822: CONN, HEADER, 4POS, 1ROW, 1.25MM ROHS COMPLIANT: YES; MF: WÃ¼rth Elektronik; SnapEDA_Link: https://www.snapeda.com/parts/653004114822/W%25C3%25BCrth+Elektronik+Midcom/view-part/?ref=snap; Package: None; Value: *; MP: 653004114822; Check_prices: https://www.snapeda.com/parts/653004114822/W%25C3%25BCrth+Elektronik+Midcom/view-part/?ref=eda
R54 R57 R58 = ERA6AHD330V: Package: None; MP: ERA6AHD330V; Price: None; Value: *; Availability: Unavailable
R55 R56 = ERA3ARB103V: MP: ERA3ARB103V; Availability: Unavailable; Package: None; Value: *; Price: None
U9 = RT9193-33GB: Linear Voltage Regulator IC Positive Fixed 1 Output 300mA TSOT-23-5; MF: Richtek USA; SnapEDA_Link: https://www.snapeda.com/parts/RT9193-33GB/Richtek+USA+Inc./view-part/?ref=snap; Package: SOT-23-5 Richtek; MP: RT9193-33GB; Check_prices: https://www.snapeda.com/parts/RT9193-33GB/Richtek+USA+Inc./view-part/?ref=eda; Purchase-URL: https://pricing.snapeda.com/search/part/RT9193-33GB/?ref=eda; Digi-Key_Part_Number: 1028-1014-2-ND; Value: *

## Sheet RGMII ETH PHY.SchDoc
size A4; SheetNumber: 18; SheetTotal: 26
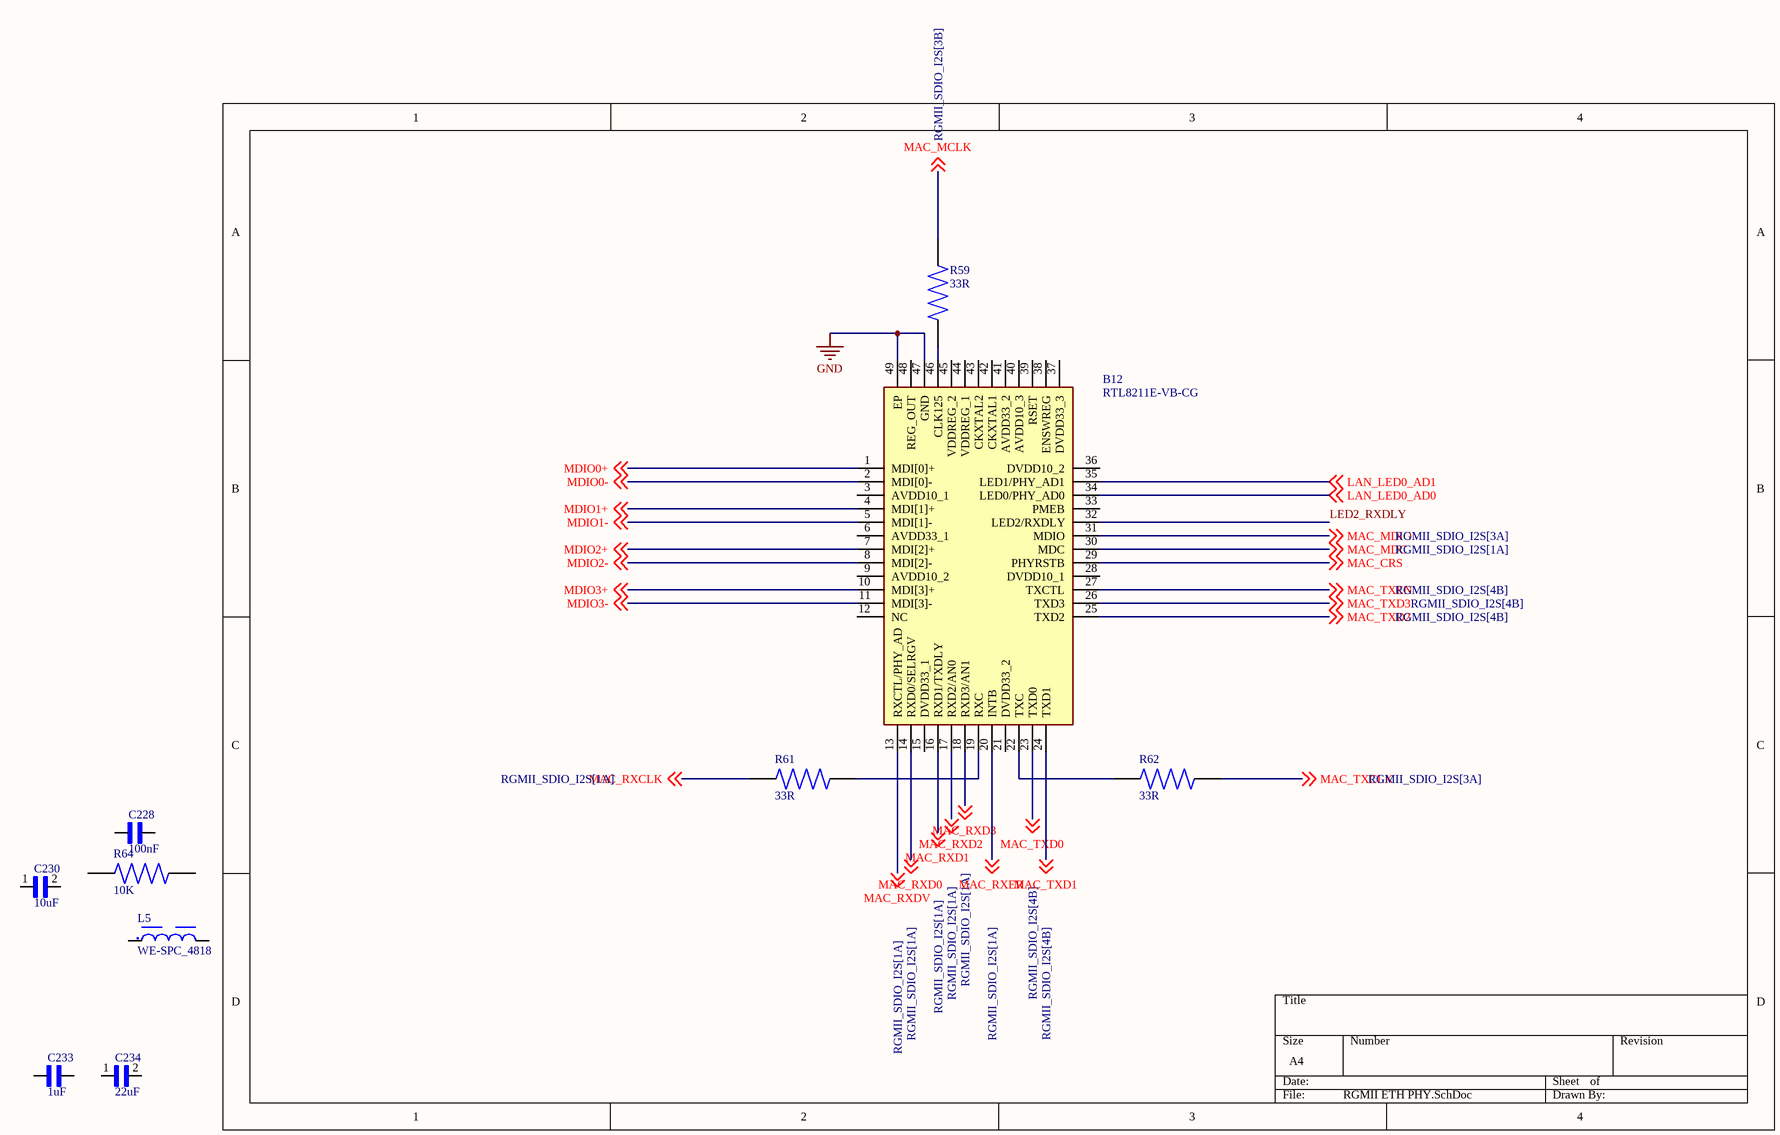
[diagram p16: RGMII ETH PHY.SchDoc]

### Parts
B12  RTL8211E-VB-CG  [QFN40P600X600X100-49N]
C228  100nF  [CAPC2012X90N]
C230  10uF  [CAPC5035X300N]
C233  1uF  [CAPC3225X140N]
C234  22uF  [CAPC6050X550N]
L5  WE-SPC_4818  [WE-SPC_4818]
R59  33R  [RES_ERA6AHD330V]
R61  33R  [RES_ERA6AHD330V]
R62  33R  [RES_ERA6AHD330V]
R64  10K  [RES_ERA3ARB103V]

### Nets
GND: B12.47(GND) B12.49(EP)
LAN_LED0_AD0: B12.34(LED0/PHY_AD0) ; off-sheet LAN_LED0_AD0
LAN_LED0_AD1: B12.35(LED1/PHY_AD1) ; off-sheet LAN_LED0_AD1
LED2_RXDLY: B12.32(LED2/RXDLY)
MAC_CRS: B12.29(PHYRSTB) ; off-sheet MAC_CRS
MAC_MCLK: R59.1 ; off-sheet MAC_MCLK
MAC_MDC: B12.30(MDC) ; off-sheet MAC_MDC
MAC_MDIO: B12.31(MDIO) ; off-sheet MAC_MDIO
MAC_RXCLK: R61.2 ; off-sheet MAC_RXCLK
MAC_RXD0: B12.14(RXD0/SELRGV) ; off-sheet MAC_RXD0
MAC_RXD1: B12.16(RXD1/TXDLY) ; off-sheet MAC_RXD1
MAC_RXD2: B12.17(RXD2/AN0) ; off-sheet MAC_RXD2
MAC_RXD3: B12.18(RXD3/AN1) ; off-sheet MAC_RXD3
MAC_RXDV: B12.13(RXCTL/PHY_AD) ; off-sheet MAC_RXDV
MAC_RXER: B12.20(INTB) ; off-sheet MAC_RXER
MAC_TXCLK: R62.1 ; off-sheet MAC_TXCLK
MAC_TXD0: B12.23(TXD0) ; off-sheet MAC_TXD0
MAC_TXD1: B12.24(TXD1) ; off-sheet MAC_TXD1
MAC_TXD2: B12.25(TXD2) ; off-sheet MAC_TXD2
MAC_TXD3: B12.26(TXD3) ; off-sheet MAC_TXD3
MAC_TXEN: B12.27(TXCTL) ; off-sheet MAC_TXEN
MDIO0+: B12.1(MDI[0]+) ; off-sheet MDIO0+
MDIO0-: B12.2(MDI[0]-) ; off-sheet MDIO0-
MDIO1+: B12.4(MDI[1]+) ; off-sheet MDIO1+
MDIO1-: B12.5(MDI[1]-) ; off-sheet MDIO1-
MDIO2+: B12.7(MDI[2]+) ; off-sheet MDIO2+
MDIO2-: B12.8(MDI[2]-) ; off-sheet MDIO2-
MDIO3+: B12.10(MDI[3]+) ; off-sheet MDIO3+
MDIO3-: B12.11(MDI[3]-) ; off-sheet MDIO3-
NetB12_19: B12.19(RXC) R61.1
NetB12_22: B12.22(TXC) R62.2
NetB12_46: B12.46(CLK125) R59.2

Not connected (* = marked no-connect by the designer): B12 3(AVDD10_1) 6(AVDD33_1) 9(AVDD10_2) 12(NC) 15(DVDD33_1) 21(DVDD33_2) 28(DVDD10_1) 33(PMEB) 36(DVDD10_2) 37(DVDD33_3) 38(ENSWREG) 39(RSET) 40(AVDD10_3) 41(AVDD33_2) 42(CKXTAL1) 43(CKXTAL2) 44(VDDREG_1) 45(VDDREG_2) 48(REG_OUT); C228 1 2; C230 1 2; C233 1 2; C234 1 2; L5 1 2; R64 1 2

### Library data of the parts
B12 = RTL8211E-VB-CG: h; Manufacturer_Name: Realtek; Geometry.Height: 1mm; Manufacturer_Part_Number: RTL8211E-VB-CG; Mouser Part Number: *; Mouser Price/Stock: *; Arrow Part Number: *; Arrow Price/Stock: *; Datasheet Link: http://download3.dvd-driver.cz/realtek/datasheets/pdf/rtl8211e(g)-vb(vl)-cg_datasheet_1.6.pdf
C228 = VJ0805Y104KXXCW1BC: Capacitor: ceramic; MLCC; 100nF; 25V; X7R; Â±10%; SMD; 0805; MF: Vishay Vitramon; SnapEDA_Link: https://www.snapeda.com/parts/VJ0805Y104KXXCW1BC/Vishay/view-part/?ref=snap; Package: 0805-2 VISHAY; Value: *; MP: VJ0805Y104KXXCW1BC; Check_prices: https://www.snapeda.com/parts/VJ0805Y104KXXCW1BC/Vishay/view-part/?ref=eda
C230 = CKG45KX7R1C106M290JH: 10ÂµF Â±20% 16V Ceramic Capacitor X7R Nonstandard SMD; MF: TDK; SnapEDA_Link: https://www.snapeda.com/parts/CKG45KX7R1C106M290JH/TDK/view-part/?ref=snap; Package: 5035 TDK; Value: *; MP: CKG45KX7R1C106M290JH; Check_prices: https://www.snapeda.com/parts/CKG45KX7R1C106M290JH/TDK/view-part/?ref=eda
C233 = C1210C105K5RACTU: Capacitor;Ceramic;Cap;1.00uF;Tol+10%;SMT;Vol-Rtg 50V;High Cap.;X7R;TR | KEMET C1210C105K5RACTU; SnapEDA_Link: https://www.snapeda.com/parts/C1210C105K5RACTU/KEMET/view-part/?ref=snap; Package: 1210-2 KEMET; Value: *; MF: KEMET; MP: C1210C105K5RACTU; Check_prices: https://www.snapeda.com/parts/C1210C105K5RACTU/KEMET/view-part/?ref=eda
C234 = CKG57NX7S1H226M500JJ: as C172 on sheet LPDDR4 SDRAM_1; MP: CKG57NX7S1H226M500JJ; Package: None; Availability: Unavailable; Price: None; Value: *
L5 = WE-SPC_4818: as L3 on sheet WIFI_MODULE; SnapEDA_Link: https://www.snapeda.com/parts/74408941100/W%25C3%25BCrth+Elektronik+Midcom/view-part/?ref=snap; Package: 1919 WÃ¼rth Elektronik; Value: *; Check_prices: https://www.snapeda.com/parts/74408941100/W%25C3%25BCrth+Elektronik+Midcom/view-part/?ref=eda
R59 R61 R62 = ERA6AHD330V: Package: None; MP: ERA6AHD330V; Price: None; Value: *; Availability: Unavailable
R64 = ERA3ARB103V: MP: ERA3ARB103V; Availability: Unavailable; Package: None; Value: *; Price: None

## Sheet RJ45 Connector and ESD Diodes.SchDoc
size A4; SheetNumber: 18; SheetTotal: 26
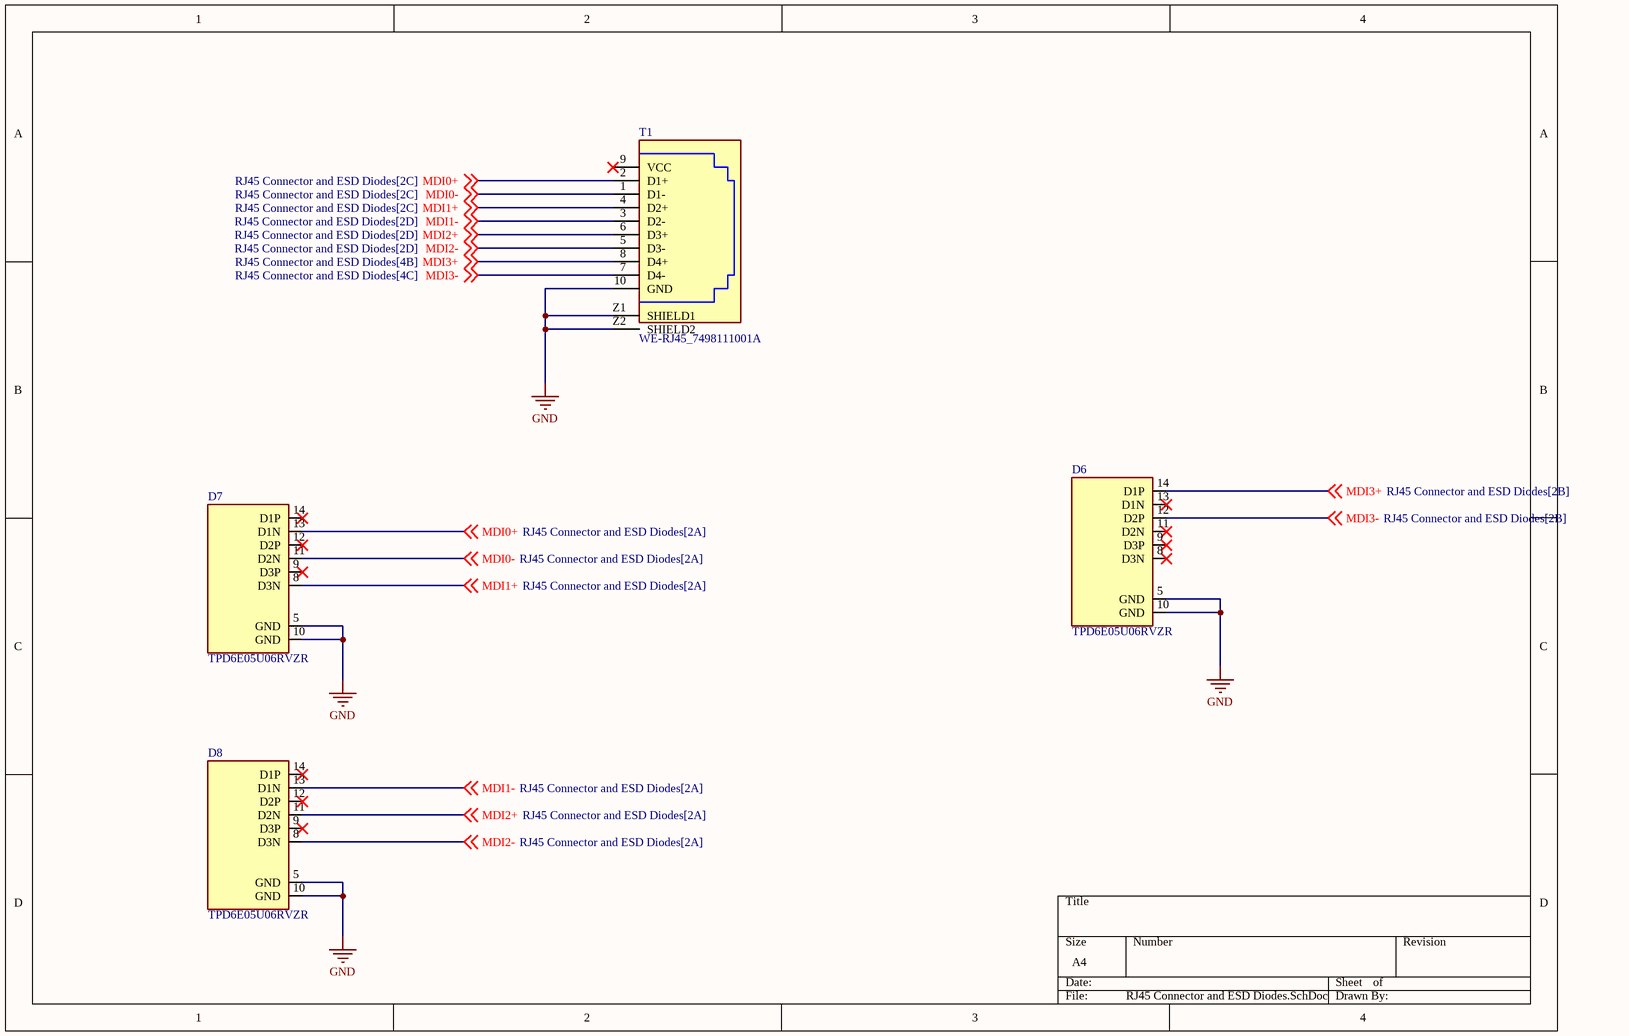
[diagram p17: RJ45 Connector and ESD Diodes.SchDoc]

### Parts
D6  TPD6E05U06RVZR  [SON50P135X350X55-14N]
D7  TPD6E05U06RVZR  [SON50P135X350X55-14N]
D8  TPD6E05U06RVZR  [SON50P135X350X55-14N]
T1  WE-RJ45_7498111001A  [7498111001A]

### Nets
GND: D6.5(GND) D6.10(GND) D7.5(GND) D7.10(GND) D8.5(GND) D8.10(GND) T1.10(GND) T1.Z1(SHIELD1) T1.Z2(SHIELD2)
MDI0+: D7.13(D1N) T1.2(D1+) ; off-sheet MDI0+
MDI0-: D7.11(D2N) T1.1(D1-) ; off-sheet MDI0-
MDI1+: D7.8(D3N) T1.4(D2+) ; off-sheet MDI1+
MDI1-: D8.13(D1N) T1.3(D2-) ; off-sheet MDI1-
MDI2+: D8.11(D2N) T1.6(D3+) ; off-sheet MDI2+
MDI2-: D8.8(D3N) T1.5(D3-) ; off-sheet MDI2-
MDI3+: D6.14(D1P) T1.8(D4+) ; off-sheet MDI3+
MDI3-: D6.12(D2P) T1.7(D4-) ; off-sheet MDI3-

Not connected (* = marked no-connect by the designer): D6 8(D3N)* 9(D3P)* 11(D2N)* 13(D1N)*; D7 9(D3P)* 12(D2P)* 14(D1P)*; D8 9(D3P)* 12(D2P)* 14(D1P)*; T1 9(VCC)*

### Library data of the parts
D6-D8 = TPD6E05U06RVZR: 6-Channel Ultra low capacitance IEC ESD protection diodes 14-USON -40 to 125; MP: TPD6E05U06RVZR; Price: None; Package: None; Value: *; Availability: Unavailable
T1 = WE-RJ45_7498111001A: EMI Gaskets, Sheets, Absorbers & Shielding Integrated RJ45 Transformer WE-RJ45LAN; MF: WÃ¼rth Elektronik; SnapEDA_Link: https://www.snapeda.com/parts/7498111001A/W%25C3%25BCrth+Elektronik+Midcom/view-part/?ref=snap; Package: None; Value: *; MP: 7498111001A; Check_prices: https://www.snapeda.com/parts/7498111001A/W%25C3%25BCrth+Elektronik+Midcom/view-part/?ref=eda